# EAGLE schematic genesys (EAGLE 9.5.1)

## Sheet 1 of 16
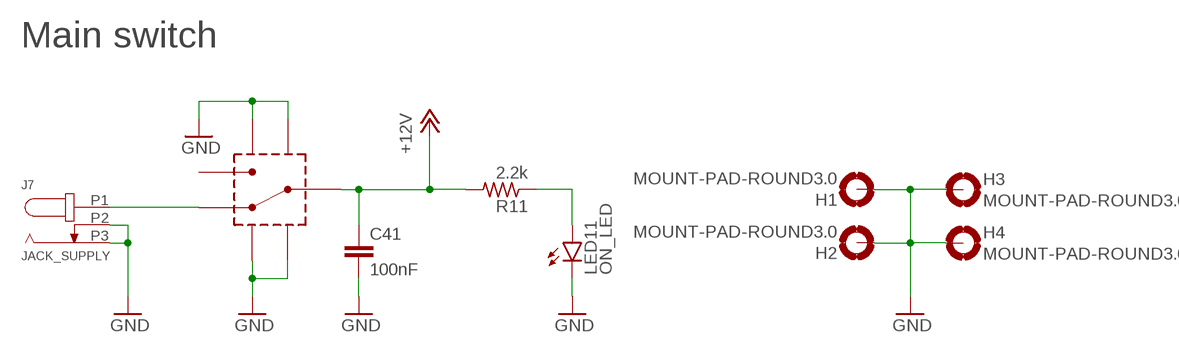
[diagram p0: schematic, sheet 1]

### Parts
C41  100nF  C-EUC0805K  [C0805K]
H1  MOUNT-PAD-ROUND3.0  [3,0-PAD]
H2  MOUNT-PAD-ROUND3.0  [3,0-PAD]
H3  MOUNT-PAD-ROUND3.0  [3,0-PAD]
H4  MOUNT-PAD-ROUND3.0  [3,0-PAD]
J7  JACK_SUPPLY  [DC-10LP]
LED11  ON_LED  LEDCHIPLED_0603  [CHIPLED_0603]
R11  2.2k  R-US_R0603  [R0603]
S1  SWITCH_1P  [SWITCH_1P]

### Nets
+12V: C41.1 R11.2 S1.P2 ; also sheet 2,4
GND: C41.2 H1.B3,0(MOUNT) H2.B3,0(MOUNT) H3.B3,0(MOUNT) H4.B3,0(MOUNT) J7.P2 J7.P3 LED11.C S1.SHIELD@1(SHIELD) S1.SHIELD@2(SHIELD) S1.SHIELD@3(SHIELD) S1.SHIELD@4(SHIELD) ; also sheet 2,3,4,5,6,7,8,9,10,11,12,13,14,15,16
N$125: J7.P1 S1.P1
N$126: LED11.A R11.1
Unconnected: S1.P3

### Notes on the sheet
- Main switch

## Sheet 2 of 16
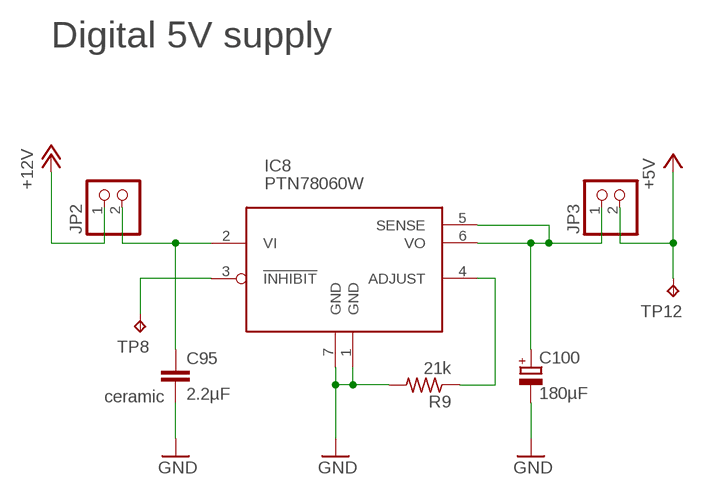
[diagram p1: schematic, sheet 2]

### Parts
C95  2.2µF  C-EUC1206  [C1206]
C100  180µF  CPOL-EUE3.5-8  [E3,5-8]
IC8  PTN78060W  [R-PDSS-T7]
JP2  PINHD-1X2  [1X02]
JP3  PINHD-1X2  [1X02]
R9  21k  R-US_R0805  [R0805]
TP8  TPTP15R  [TP15R]
TP12  TPTP15R  [TP15R]

### Nets
+5V: JP3.2 TP12.TP ; also sheet 3,5,7,8,13
+12V: JP2.1 ; also sheet 1,4
GND: C95.2 C100.- IC8.1(GND) IC8.7(GND) R9.2 ; also sheet 1,3,4,5,6,7,8,9,10,11,12,13,14,15,16
N$4: C95.1 IC8.2(VI) JP2.2
N$16: C100.+ IC8.5(SENSE) IC8.6(VO) JP3.1
N$91: IC8.3(!INHIBIT) TP8.TP
N$116: IC8.4(ADJUST) R9.1

### Notes on the sheet
- Digital 5V supply
- ceramic

## Sheet 3 of 16
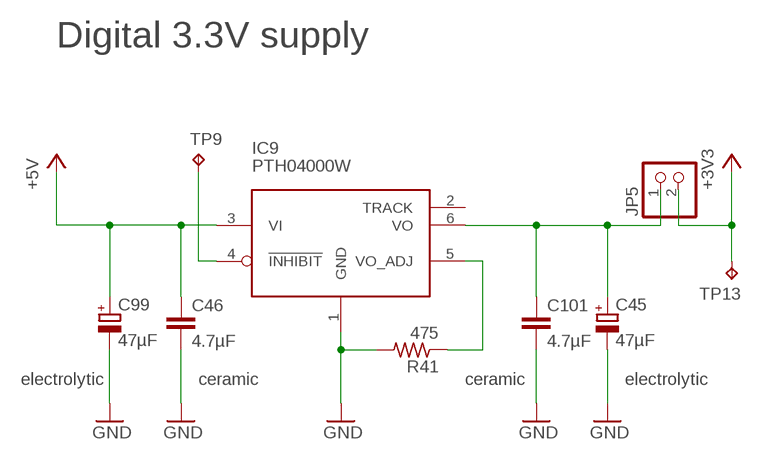
[diagram p2: schematic, sheet 3]

### Parts
C45  47µF  CPOL-EUE2.5-7  [E2,5-7]
C46  4.7µF  C-EUC0805K  [C0805K]
C99  47µF  CPOL-EUE2.5-7  [E2,5-7]
C101  4.7µF  C-EUC0805K  [C0805K]
IC9  PTH04000W  [R-PDSS-T6]
JP5  PINHD-1X2  [1X02]
R41  475  R-US_R0805  [R0805]
TP9  TPTP15R  [TP15R]
TP13  TPTP15R  [TP15R]

### Nets
+3V3: JP5.2 TP13.TP ; also sheet 5,6,7,8,9,10,11,12,13,14
+5V: C46.1 C99.+ IC9.3(VI) ; also sheet 2,5,7,8,13
GND: C45.- C46.2 C99.- C101.2 IC9.1(GND) R41.2 ; also sheet 1,2,4,5,6,7,8,9,10,11,12,13,14,15,16
N$51: IC9.5(VO_ADJ) R41.1
N$92: IC9.4(!INHIBIT) TP9.TP
N$120: C45.+ C101.1 IC9.6(VO) JP5.1

### Notes on the sheet
- Digital 3.3V supply
- electrolytic | ceramic | ceramic | electrolytic

## Sheet 4 of 16
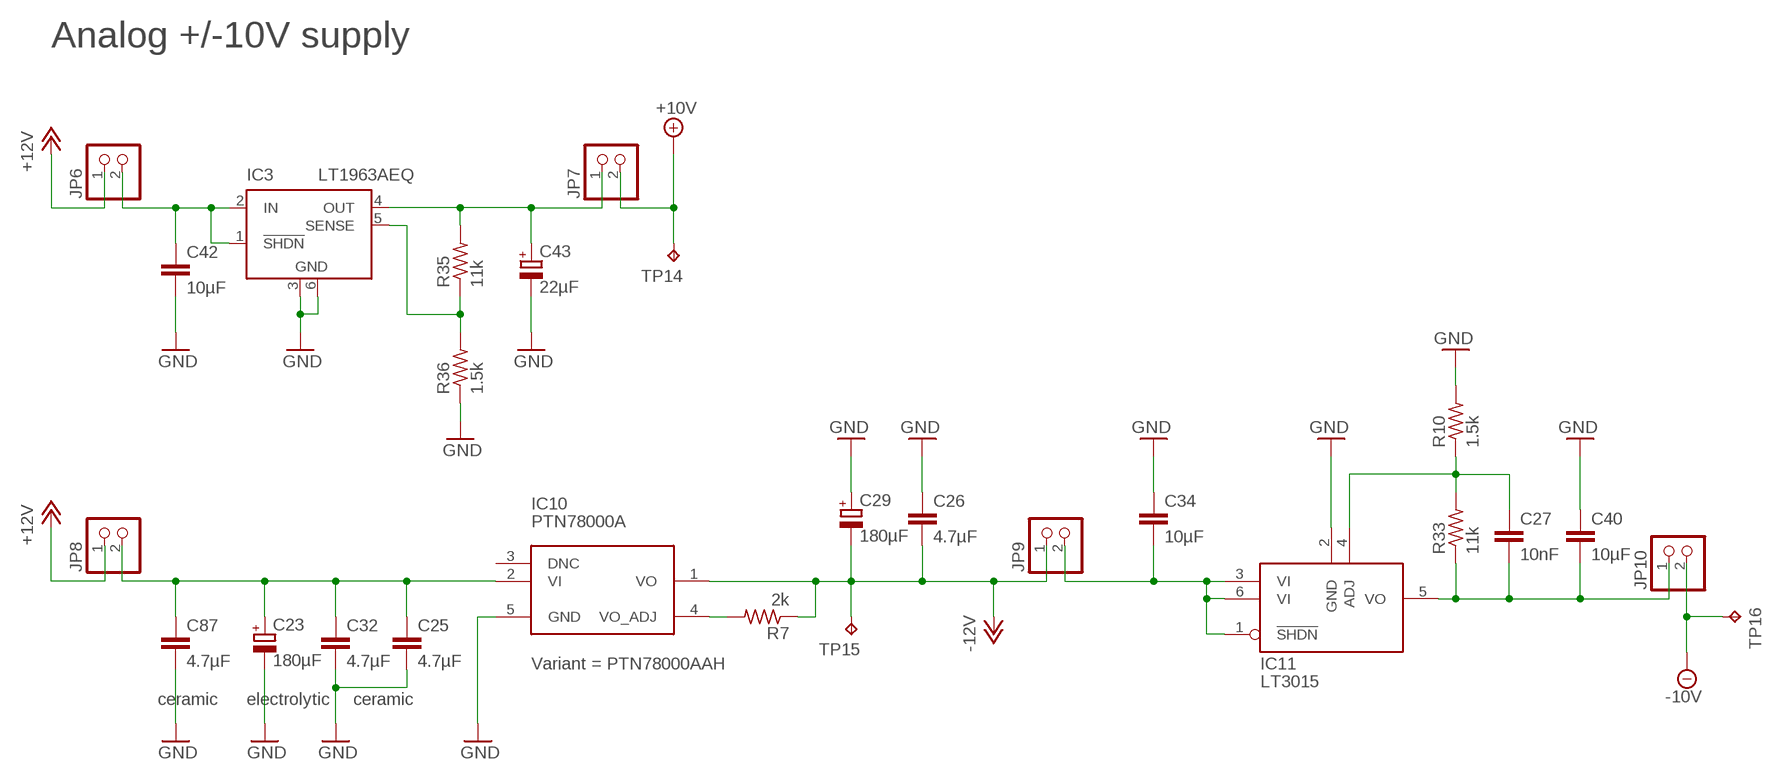
[diagram p3: schematic, sheet 4]

### Parts
C23  180µF  CPOL-EUE3.5-8  [E3,5-8]
C25  4.7µF  C-EUC0805K  [C0805K]
C26  4.7µF  C-EUC0805K  [C0805K]
C27  10nF  C-EUC0805K  [C0805K]
C29  180µF  CPOL-EUE3.5-8  [E3,5-8]
C32  4.7µF  C-EUC0805K  [C0805K]
C34  10µF  C-EUC0805K  [C0805K]
C40  10µF  C-EUC0805K  [C0805K]
C42  10µF  C-EUC0805K  [C0805K]
C43  22µF  CPOL-EUCT3528  [CT3528]
C87  4.7µF  C-EUC0805K  [C0805K]
IC3  LT1963AEQ  [Q5-DD]
IC10  PTN78000A  [R-PDSS-T5]
IC11  LT3015  [Q5-DD]
JP6  PINHD-1X2  [1X02]
JP7  PINHD-1X2  [1X02]
JP8  PINHD-1X2  [1X02]
JP9  PINHD-1X2  [1X02]
JP10  PINHD-1X2  [1X02]
R7  2k  R-US_R0805  [R0805]
R10  1.5k  R-US_R0805  [R0805]
R33  11k  R-US_R0805  [R0805]
R35  11k  R-US_R0805  [R0805]
R36  1.5k  R-US_R0805  [R0805]
TP14  TPTP15R  [TP15R]
TP15  TPTP15R  [TP15R]
TP16  TPTP15R  [TP15R]

### Nets
+10V: JP7.2 TP14.TP ; also sheet 15,16
+12V: JP6.1 JP8.1 ; also sheet 1,2
-10V: JP10.2 TP16.TP ; also sheet 15,16
-12V: C26.2 C29.- IC10.1(VO) JP9.1 R7.1 TP15.TP
GND: C23.- C25.2 C26.1 C29.+ C32.2 C34.1 C40.1 C42.2 C43.- C87.2 IC3.3(GND) IC3.6(GND) IC10.5(GND) IC11.2(GND) R10.2 R36.1 ; also sheet 1,2,3,5,6,7,8,9,10,11,12,13,14,15,16
N$36: IC3.5(SENSE) R35.1 R36.2
N$117: IC10.4(VO_ADJ) R7.2
N$118: C27.1 IC11.4(ADJ) R10.1 R33.2
N$119: C42.1 IC3.1(!SHDN) IC3.2(IN) JP6.2
N$121: C43.+ IC3.4(OUT) JP7.1 R35.2
N$122: C34.2 IC11.1(!SHDN) IC11.3(VI) IC11.6(VI) JP9.2
N$123: C23.+ C25.1 C32.1 C87.1 IC10.2(VI) JP8.2
N$124: C27.2 C40.2 IC11.5(VO) JP10.1 R33.1
Unconnected: IC10.3(DNC)

### Notes on the sheet
- Analog +/-10V supply
- Variant = PTN78000AAH
- ceramic | electrolytic | ceramic

## Sheet 5 of 16
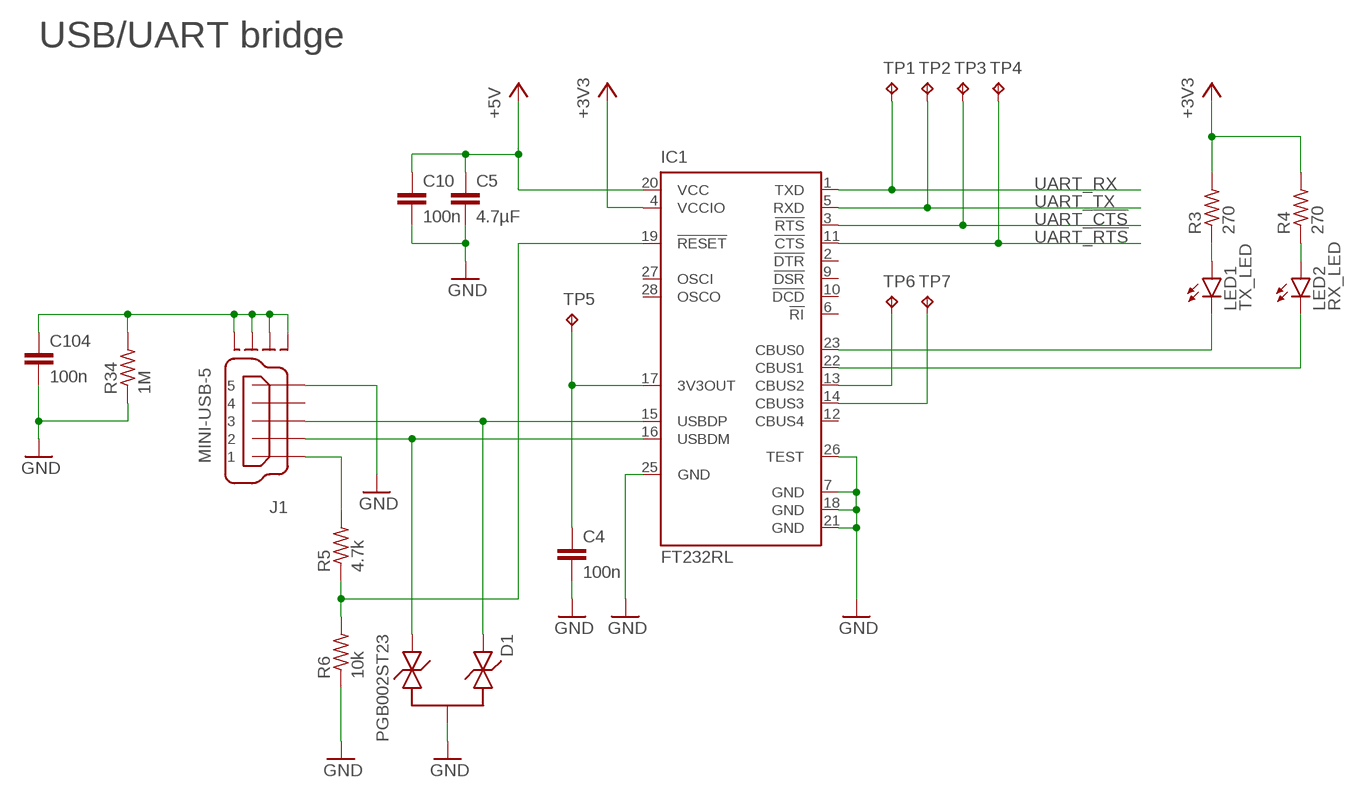
[diagram p4: schematic, sheet 5]

### Parts
C4  100n  C-EUC0805K  [C0805K]
C5  4.7µF  C-EUC0805K  [C0805K]
C10  100n  C-EUC0805K  [C0805K]
C104  100n  C-EUC0805K  [C0805K]
D1  PGB002ST23  [SOT23]
IC1  FT232RL  [SSOP28]
J1  MINI-USB-5  [56579-0579]
LED1  TX_LED  LEDCHIPLED_0603  [CHIPLED_0603]
LED2  RX_LED  LEDCHIPLED_0603  [CHIPLED_0603]
R3  270  R-US_R0603  [R0603]
R4  270  R-US_R0603  [R0603]
R5  4.7k  R-US_R0603  [R0603]
R6  10k  R-US_R0603  [R0603]
R34  1M  R-US_R0603  [R0603]
TP1  TPTP15R  [TP15R]
TP2  TPTP15R  [TP15R]
TP3  TPTP15R  [TP15R]
TP4  TPTP15R  [TP15R]
TP5  TPTP15R  [TP15R]
TP6  TPTP15R  [TP15R]
TP7  TPTP15R  [TP15R]

### Nets
+3V3: IC1.4(VCCIO) R3.2 R4.2 ; also sheet 3,6,7,8,9,10,11,12,13,14
+5V: C5.1 C10.1 IC1.20(VCC) ; also sheet 2,3,7,8,13
GND: C4.2 C5.2 C10.2 C104.2 D1.3 IC1.7(GND) IC1.18(GND) IC1.21(GND) IC1.25(GND) IC1.26(TEST) J1.GND R6.1 R34.1 ; also sheet 1,2,3,4,6,7,8,9,10,11,12,13,14,15,16
N$1: C4.1 IC1.17(3V3OUT) TP5.TP
N$5: IC1.23(CBUS0) LED1.C
N$6: IC1.22(CBUS1) LED2.C
N$7: LED1.A R3.1
N$8: LED2.A R4.1
N$9: D1.2 IC1.16(USBDM) J1.DN
N$10: J1.VBUS R5.2
N$11: IC1.19(!RESET) R5.1 R6.2
N$12: D1.1 IC1.15(USBDP) J1.DP
N$58: IC1.13(CBUS2) TP6.TP
N$88: IC1.14(CBUS3) TP7.TP
N$93: C104.1 J1.SHIELD@1(S1) J1.SHIELD@2(S2) J1.SHIELD@3(S3) J1.SHIELD@4(S4) R34.2
UART_!CTS: IC1.3(!RTS) TP3.TP ; also sheet 7
UART_!RTS: IC1.11(!CTS) TP4.TP ; also sheet 7
UART_RX: IC1.1(TXD) TP1.TP ; also sheet 7
UART_TX: IC1.5(RXD) TP2.TP ; also sheet 7
Unconnected: IC1.2(!DTR) IC1.6(!RI) IC1.9(!DSR) IC1.10(!DCD) IC1.12(CBUS4) IC1.27(OSCI) IC1.28(OSCO) J1.NC

### Notes on the sheet
- USB/UART bridge

## Sheet 6 of 16
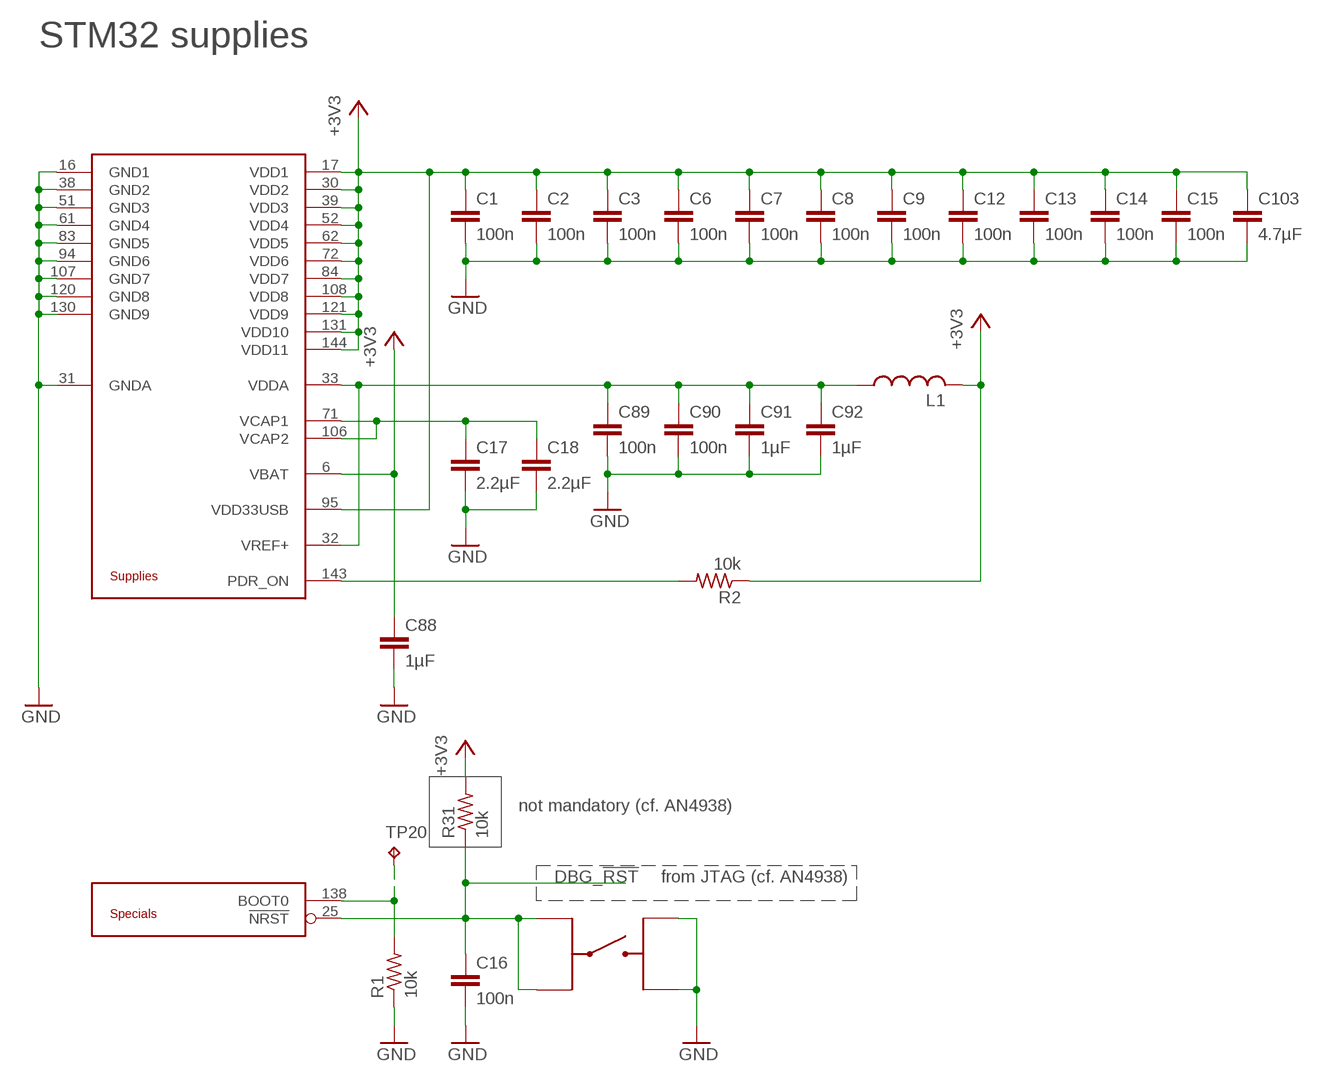
[diagram p5: schematic, sheet 6]

### Parts
B1  KSC521G  [KSC521G]
C1  100n  C-EUC0805K  [C0805K]
C2  100n  C-EUC0805K  [C0805K]
C3  100n  C-EUC0805K  [C0805K]
C6  100n  C-EUC0805K  [C0805K]
C7  100n  C-EUC0805K  [C0805K]
C8  100n  C-EUC0805K  [C0805K]
C9  100n  C-EUC0805K  [C0805K]
C12  100n  C-EUC0805K  [C0805K]
C13  100n  C-EUC0805K  [C0805K]
C14  100n  C-EUC0805K  [C0805K]
C15  100n  C-EUC0805K  [C0805K]
C16  100n  C-EUC0805K  [C0805K]
C17  2.2µF  C-EUC0805K  [C0805K]
C18  2.2µF  C-EUC0805K  [C0805K]
C88  1µF  C-EUC0805K  [C0805K]
C89  100n  C-EUC0805K  [C0805K]
C90  100n  C-EUC0805K  [C0805K]
C91  1µF  C-EUC0805K  [C0805K]
C92  1µF  C-EUC0805K  [C0805K]
C103  4.7µF  C-EUC0805K  [C0805K]
L1  L-USL3216C  [L3216C]
R1  10k  R-US_R0805  [R0805]
R2  10k  R-US_R0805  [R0805]
R31  10k  R-US_R0805  [R0805]
TP20  TPTP15R  [TP15R]
U$1  STM32H743ZI  [TQFP144]

### Nets
+3V3: C1.1 C2.1 C3.1 C6.1 C7.1 C8.1 C9.1 C12.1 C13.1 C14.1 C15.1 C88.1 C103.1 L1.2 R2.1 R31.2 U$1.6(VBAT) U$1.17(VDD1) U$1.30(VDD2) U$1.39(VDD3) U$1.52(VDD4) U$1.62(VDD5) U$1.72(VDD6) U$1.84(VDD7) U$1.95(VDD33USB) U$1.108(VDD8) U$1.121(VDD9) U$1.131(VDD10) U$1.144(VDD11) ; also sheet 3,5,7,8,9,10,11,12,13,14
DBG_!RST: B1.3 B1.4 C16.1 R31.1 U$1.25(!NRST) ; also sheet 12
GND: B1.1 B1.2 C1.2 C2.2 C3.2 C6.2 C7.2 C8.2 C9.2 C12.2 C13.2 C14.2 C15.2 C16.2 C17.2 C18.2 C88.2 C89.2 C90.2 C91.2 C92.2 C103.2 R1.1 U$1.16(GND1) U$1.31(GNDA) U$1.38(GND2) U$1.51(GND3) U$1.61(GND4) U$1.83(GND5) U$1.94(GND6) U$1.107(GND7) U$1.120(GND8) U$1.130(GND9) ; also sheet 1,2,3,4,5,7,8,9,10,11,12,13,14,15,16
N$2: R1.2 TP20.TP U$1.138(BOOT0)
N$3: C89.1 C90.1 C91.1 C92.1 L1.1 U$1.32(VREF+) U$1.33(VDDA)
N$13: R2.2 U$1.143(PDR_ON)
N$14: C17.1 C18.1 U$1.71(VCAP1) U$1.106(VCAP2)

### Notes on the sheet
- STM32 supplies
- not mandatory (cf. AN4938)
- from JTAG (cf. AN4938)

## Sheet 7 of 16
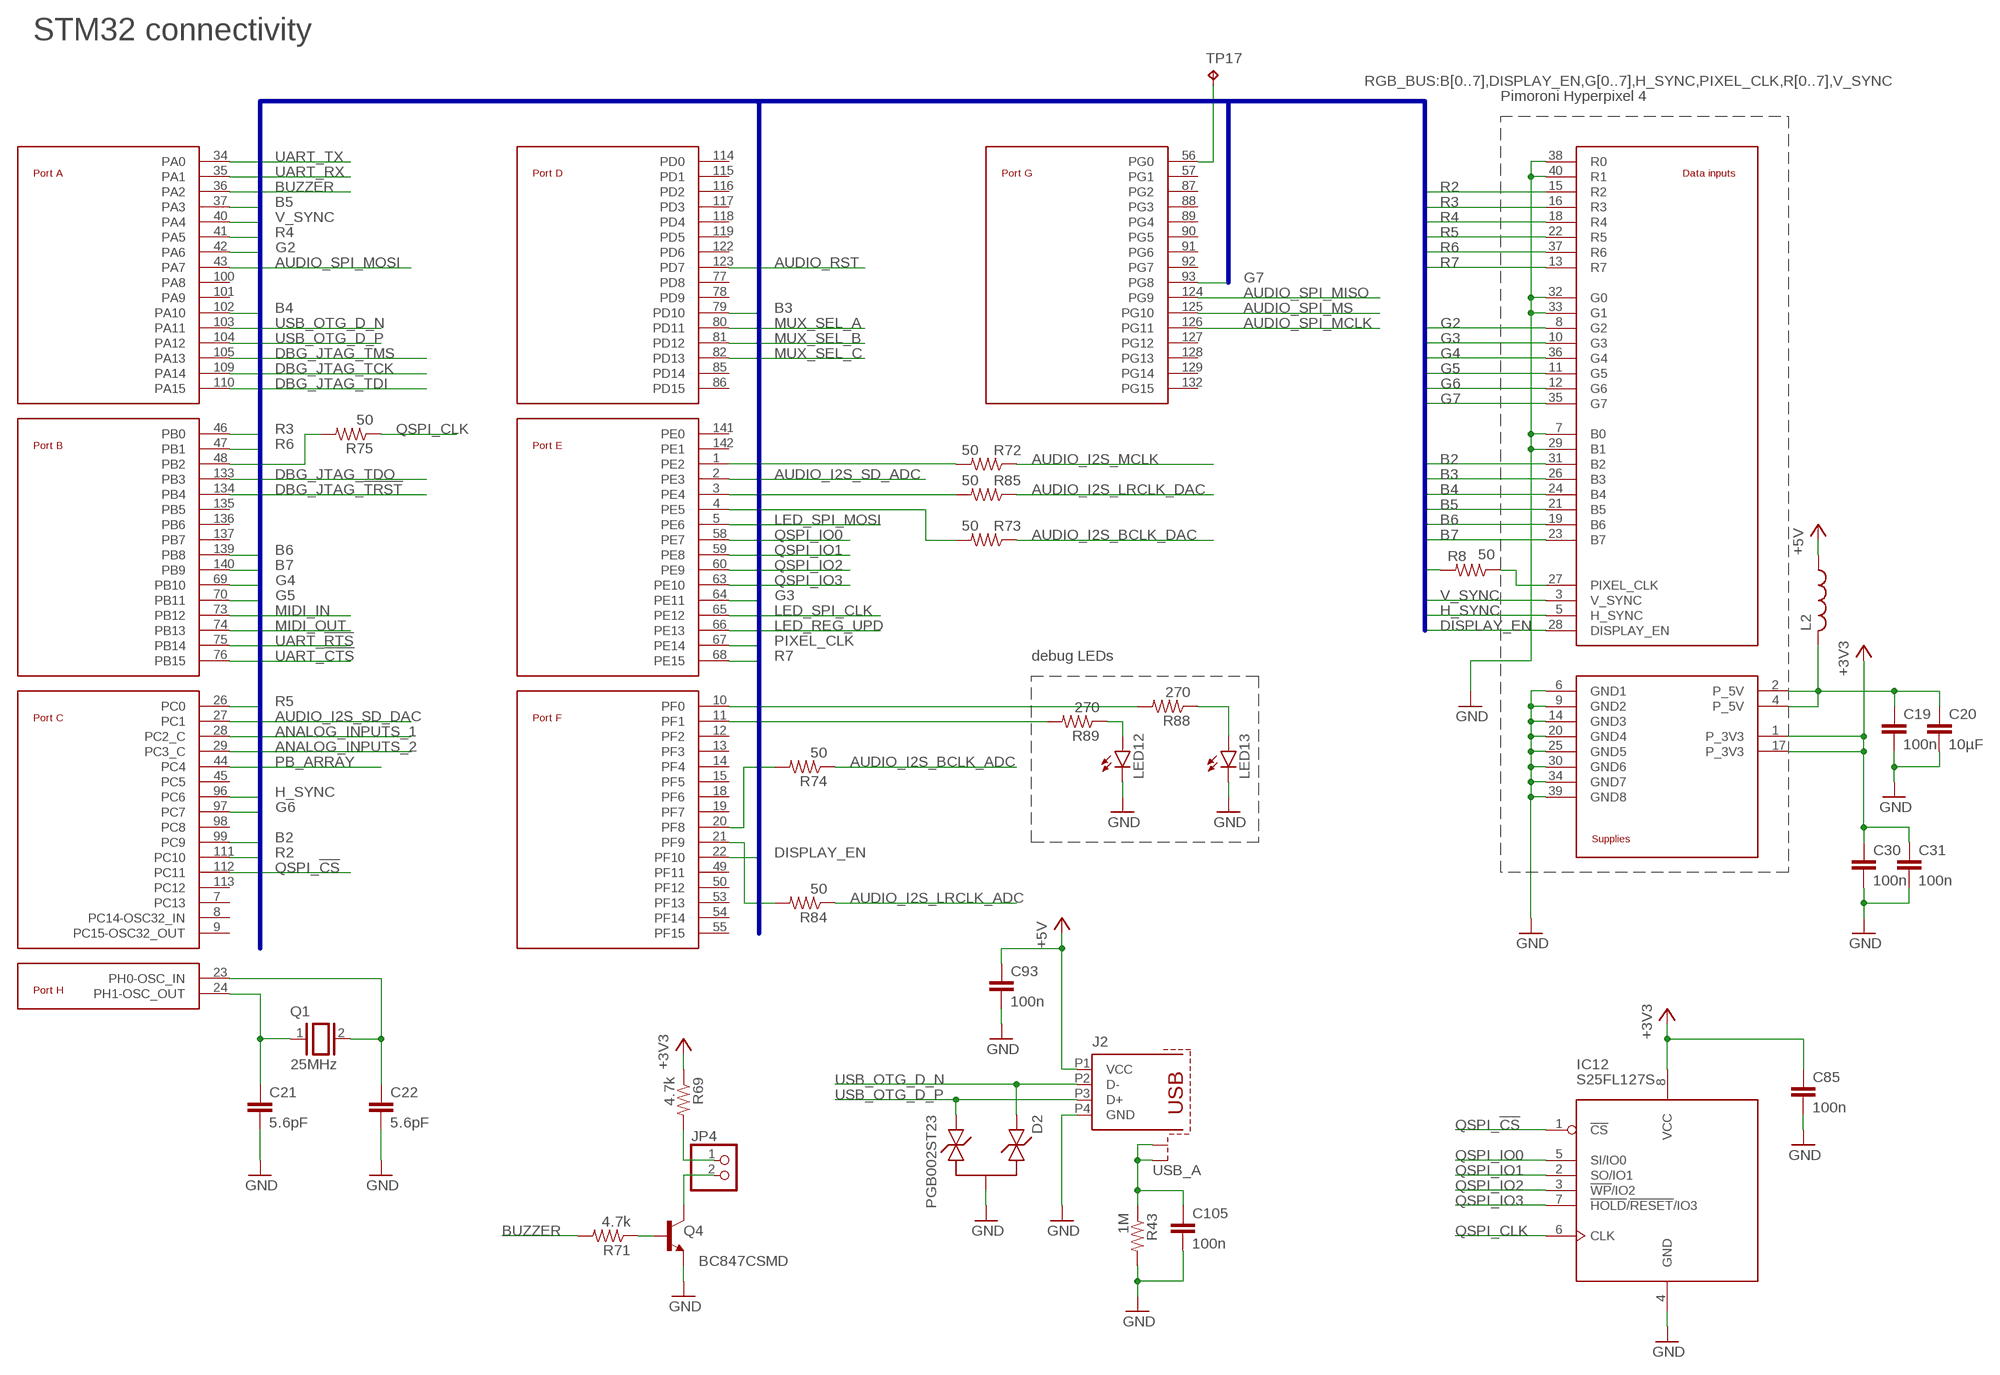
[diagram p6: schematic, sheet 7]

### Parts
C19  100n  C-EUC0805K  [C0805K]
C20  10µF  C-EUC0805K  [C0805K]
C21  5.6pF  C-EUC0805K  [C0805K]
C22  5.6pF  C-EUC0805K  [C0805K]
C30  100n  C-EUC0805K  [C0805K]
C31  100n  C-EUC0805K  [C0805K]
C85  100n  C-EUC0805K  [C0805K]
C93  100n  C-EUC0805K  [C0805K]
C105  100n  C-EUC0805K  [C0805K]
D2  PGB002ST23  [SOT23]
IC12  S25FL127S  [SO8]
J2  USB_A  [USB_A]
JP4  PINHD-1X2  [1X02]
L2  L-USL3216C  [L3216C]
LED12  USR_LED_1  LEDCHIPLED_0603  [CHIPLED_0603]
LED13  USR_LED_1  LEDCHIPLED_0603  [CHIPLED_0603]
Q1  25MHz  XTAL/S  [QS]
Q4  BC847CSMD  [SOT23]
R8  50  R-US_R0805  [R0805]
R43  1M  R-US_R0603  [R0603]
R69  4.7k  R-US_R0805  [R0805]
R71  4.7k  R-US_R0805  [R0805]
R72  50  R-US_R0603  [R0603]
R73  50  R-US_R0603  [R0603]
R74  50  R-US_R0603  [R0603]
R75  50  R-US_R0603  [R0603]
R84  50  R-US_R0603  [R0603]
R85  50  R-US_R0603  [R0603]
R88  270  R-US_R0603  [R0603]
R89  270  R-US_R0603  [R0603]
TP17  TPTP15R  [TP15R]
U$2  HYPERPIXEL4.0  [HYPERPIXEL4.0]

### Nets
+3V3: C30.1 C31.1 C85.1 IC12.8(VCC) R69.1 U$2.1(SUPP:P_3V3) U$2.17(SUPP:P_3V3) ; also sheet 3,5,6,8,9,10,11,12,13,14
+5V: C93.1 J2.P1(VCC) L2.1 ; also sheet 2,3,5,8,13
ANALOG_INPUTS_1: U$1.28(PC2_C) ; also sheet 9
ANALOG_INPUTS_2: U$1.29(PC3_C) ; also sheet 9
AUDIO_I2S_BCLK_ADC: R74.1 ; also sheet 14
AUDIO_I2S_BCLK_DAC: R73.1 ; also sheet 14
AUDIO_I2S_LRCLK_ADC: R84.1 ; also sheet 14
AUDIO_I2S_LRCLK_DAC: R85.1 ; also sheet 14
AUDIO_I2S_MCLK: R72.1 ; also sheet 14
AUDIO_I2S_SD_ADC: U$1.2(PE3) ; also sheet 14
AUDIO_I2S_SD_DAC: U$1.27(PC1) ; also sheet 14
AUDIO_RST: U$1.123(PD7) ; also sheet 14
AUDIO_SPI_MCLK: U$1.126(PG11) ; also sheet 14
AUDIO_SPI_MISO: U$1.124(PG9) ; also sheet 14
AUDIO_SPI_MOSI: U$1.43(PA7) ; also sheet 14
AUDIO_SPI_MS: U$1.125(PG10) ; also sheet 14
B2: U$1.99(PC9) U$2.31(DISP:B2)
B3: U$1.79(PD10) U$2.26(DISP:B3)
B4: U$1.102(PA10) U$2.24(DISP:B4)
B5: U$1.37(PA3) U$2.21(DISP:B5)
B6: U$1.139(PB8) U$2.19(DISP:B6)
B7: U$1.140(PB9) U$2.23(DISP:B7)
BUZZER: R71.2 U$1.36(PA2)
DBG_JTAG_!TRST: U$1.134(PB4) ; also sheet 12
DBG_JTAG_TCK: U$1.109(PA14) ; also sheet 12
DBG_JTAG_TDI: U$1.110(PA15) ; also sheet 12
DBG_JTAG_TDO: U$1.133(PB3) ; also sheet 12
DBG_JTAG_TMS: U$1.105(PA13) ; also sheet 12
DISPLAY_EN: U$1.22(PF10) U$2.28(DISP:DISPLAY_EN)
G2: U$1.42(PA6) U$2.8(DISP:G2)
G3: U$1.64(PE11) U$2.10(DISP:G3)
G4: U$1.69(PB10) U$2.36(DISP:G4)
G5: U$1.70(PB11) U$2.11(DISP:G5)
G6: U$1.97(PC7) U$2.12(DISP:G6)
G7: U$1.93(PG8) U$2.35(DISP:G7)
GND: C19.2 C20.2 C21.2 C22.2 C30.2 C31.2 C85.2 C93.2 C105.2 D2.3 IC12.4(GND) J2.P4(GND) LED12.C LED13.C Q4.2(E) R43.2 U$2.6(SUPP:GND1) U$2.7(DISP:B0) U$2.9(SUPP:GND2) U$2.14(SUPP:GND3) U$2.20(SUPP:GND4) U$2.25(SUPP:GND5) U$2.29(DISP:B1) U$2.30(SUPP:GND6) U$2.32(DISP:G0) U$2.33(DISP:G1) U$2.34(SUPP:GND7) U$2.38(DISP:R0) U$2.39(SUPP:GND8) U$2.40(DISP:R1) ; also sheet 1,2,3,4,5,6,8,9,10,11,12,13,14,15,16
H_SYNC: U$1.96(PC6) U$2.5(DISP:H_SYNC)
LED_REG_UPD: U$1.66(PE13) ; also sheet 10
LED_SPI_CLK: U$1.65(PE12) ; also sheet 10
LED_SPI_MOSI: U$1.5(PE6) ; also sheet 10
MIDI_IN: U$1.73(PB12) ; also sheet 8
MIDI_OUT: U$1.74(PB13) ; also sheet 8
MUX_SEL_A: U$1.80(PD11) ; also sheet 9,11
MUX_SEL_B: U$1.81(PD12) ; also sheet 9,11
MUX_SEL_C: U$1.82(PD13) ; also sheet 9,11
N$15: R8.1 U$2.27(DISP:PIXEL_CLK)
N$17: C21.1 Q1.1 U$1.24(PH1-OSC_OUT)
N$18: C22.1 Q1.2 U$1.23(PH0-OSC_IN)
N$26: C19.1 C20.1 L2.2 U$2.2(SUPP:P_5V) U$2.4(SUPP:P_5V)
N$112: R88.2 U$1.10(PF0)
N$113: R89.2 U$1.11(PF1)
N$114: LED12.A R89.1
N$115: LED13.A R88.1
N$130: C105.1 J2.SHIELD@1(S1) J2.SHIELD@2(S2) R43.1
N$131: JP4.1 R69.2
N$132: JP4.2 Q4.3(C)
N$133: R72.2 U$1.1(PE2)
N$134: Q4.1(B) R71.1
N$135: R73.2 U$1.4(PE5)
N$136: R74.2 U$1.20(PF8)
N$137: R75.2 U$1.48(PB2)
N$138: TP17.TP U$1.56(PG0)
N$139: R84.2 U$1.21(PF9)
N$140: R85.2 U$1.3(PE4)
PB_ARRAY: U$1.44(PC4) ; also sheet 11
PIXEL_CLK: R8.2 U$1.67(PE14)
QSPI_!CS: IC12.1(!CS) U$1.112(PC11)
QSPI_CLK: IC12.6(CLK) R75.1
QSPI_IO0: IC12.5(SI/IO0) U$1.58(PE7)
QSPI_IO1: IC12.2(SO/IO1) U$1.59(PE8)
QSPI_IO2: IC12.3(!WP!/IO2) U$1.60(PE9)
QSPI_IO3: IC12.7(!HOLD!/!RESET!/IO3) U$1.63(PE10)
R2: U$1.111(PC10) U$2.15(DISP:R2)
R3: U$1.46(PB0) U$2.16(DISP:R3)
R4: U$1.41(PA5) U$2.18(DISP:R4)
R5: U$1.26(PC0) U$2.22(DISP:R5)
R6: U$1.47(PB1) U$2.37(DISP:R6)
R7: U$1.68(PE15) U$2.13(DISP:R7)
UART_!CTS: U$1.76(PB15) ; also sheet 5
UART_!RTS: U$1.75(PB14) ; also sheet 5
UART_RX: U$1.35(PA1) ; also sheet 5
UART_TX: U$1.34(PA0) ; also sheet 5
USB_OTG_D_N [USB diff pair]: D2.1 J2.P2(D-) U$1.103(PA11)
USB_OTG_D_P [USB diff pair]: D2.2 J2.P3(D+) U$1.104(PA12)
V_SYNC: U$1.40(PA4) U$2.3(DISP:V_SYNC)
Unconnected: U$1.7(PC13) U$1.8(PC14-OSC32_IN) U$1.9(PC15-OSC32_OUT) U$1.12(PF2) U$1.13(PF3) U$1.14(PF4) U$1.15(PF5) U$1.18(PF6) U$1.19(PF7) U$1.45(PC5) U$1.49(PF11) U$1.50(PF12) U$1.53(PF13) U$1.54(PF14) U$1.55(PF15) U$1.57(PG1) U$1.77(PD8) U$1.78(PD9) U$1.85(PD14) U$1.86(PD15) U$1.87(PG2) U$1.88(PG3) U$1.89(PG4) U$1.90(PG5) U$1.91(PG6) U$1.92(PG7) U$1.98(PC8) U$1.100(PA8) U$1.101(PA9) U$1.113(PC12) U$1.114(PD0) U$1.115(PD1) U$1.116(PD2) U$1.117(PD3) U$1.118(PD4) U$1.119(PD5) U$1.122(PD6) U$1.127(PG12) U$1.128(PG13) U$1.129(PG14) U$1.132(PG15) U$1.135(PB5) U$1.136(PB6) U$1.137(PB7) U$1.141(PE0) U$1.142(PE1)

### Buses
RGB_BUS:B[0..7],DISPLAY_EN,G[0..7],H_SYNC,PIXEL_CLK,R[0..7],V_SYNC

### Notes on the sheet
- STM32 connectivity
- Pimoroni Hyperpixel 4
- debug LEDs

## Sheet 8 of 16
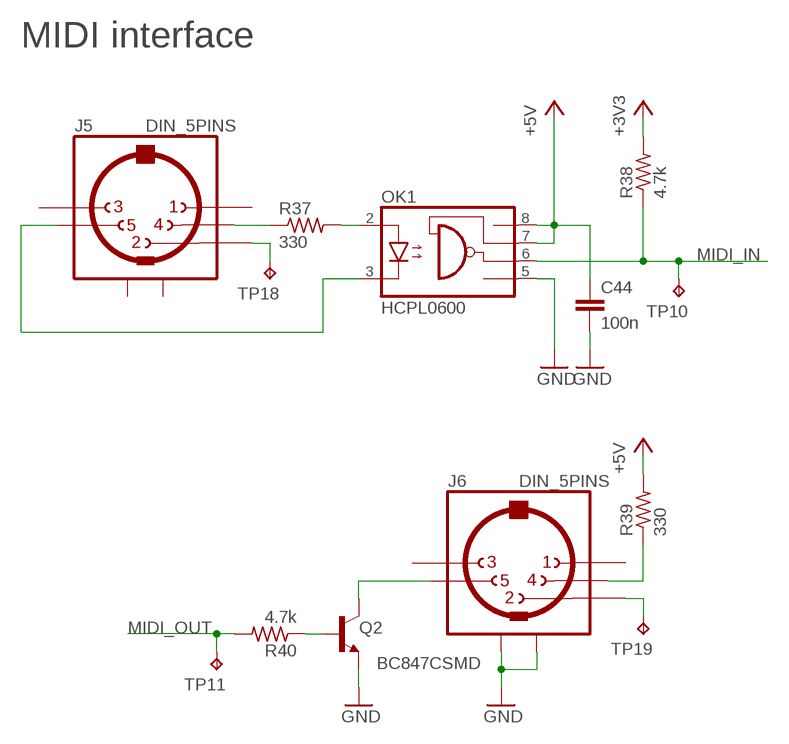
[diagram p7: schematic, sheet 8]

### Parts
C44  100n  C-EUC0805K  [C0805K]
J5  DIN_5PINS  [71251-050/0800]
J6  DIN_5PINS  [71251-050/0800]
OK1  HCPL0600  [SOIC08]
Q2  BC847CSMD  [SOT23]
R37  330  R-US_R0805  [R0805]
R38  4.7k  R-US_R0805  [R0805]
R39  330  R-US_R0805  [R0805]
R40  4.7k  R-US_R0805  [R0805]
TP10  TPTP15R  [TP15R]
TP11  TPTP15R  [TP15R]
TP18  TPTP15R  [TP15R]
TP19  TPTP15R  [TP15R]

### Nets
+3V3: R38.2 ; also sheet 3,5,6,7,9,10,11,12,13,14
+5V: C44.1 OK1.7(VE) OK1.8(VCC) R39.2 ; also sheet 2,3,5,7,13
GND: C44.2 J6.GND@1(SHIELD) J6.GND@2(SHIELD) OK1.5(GND) Q2.2(E) ; also sheet 1,2,3,4,5,6,7,9,10,11,12,13,14,15,16
MIDI_IN: OK1.6(VO) R38.1 TP10.TP ; also sheet 7
MIDI_OUT: R40.2 TP11.TP ; also sheet 7
N$39: J6.P4 R39.1
N$44: OK1.2(A) R37.2
N$45: J5.P5 OK1.3(C)
N$47: J5.P4 R37.1
N$48: J6.P5 Q2.3(C)
N$49: Q2.1(B) R40.1
N$141: J5.P2 TP18.TP
N$142: J6.P2 TP19.TP
Unconnected: J5.P1 J5.P3 J6.P1 J6.P3

### Notes on the sheet
- MIDI interface

## Sheet 9 of 16
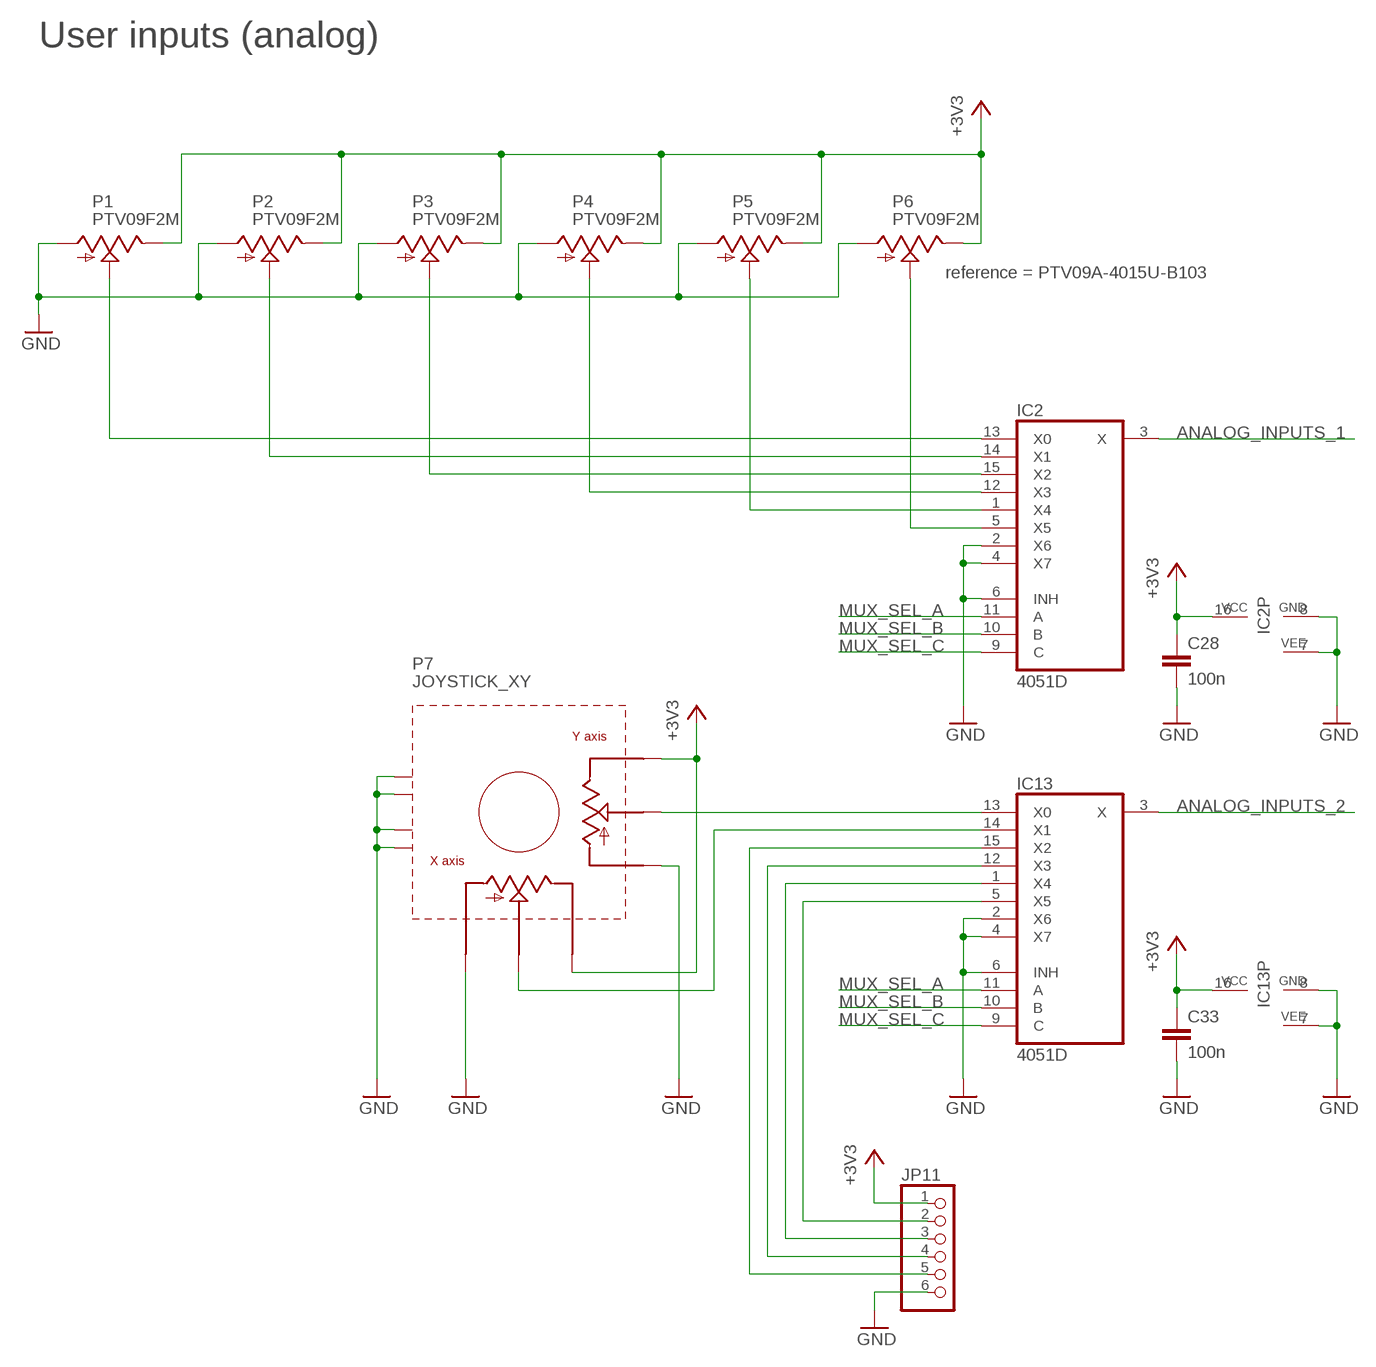
[diagram p8: schematic, sheet 9]

### Parts
C28  100n  C-EUC0805K  [C0805K]
C33  100n  C-EUC0805K  [C0805K]
IC2  4051D  [SO16]
IC13  4051D  [SO16]
JP11  PINHD-1X6  [1X06]
P1  PTV09F2M  [EVUFXM]
P2  PTV09F2M  [EVUFXM]
P3  PTV09F2M  [EVUFXM]
P4  PTV09F2M  [EVUFXM]
P5  PTV09F2M  [EVUFXM]
P6  PTV09F2M  [EVUFXM]
P7  JOYSTICK_XY  [RKJXK1210002]

### Nets
+3V3: C28.1 C33.1 IC2.16(VCC) IC13.16(VCC) JP11.1 P1.3(E) P2.3(E) P3.3(E) P4.3(E) P5.3(E) P6.3(E) P7.PX3 P7.PY3 ; also sheet 3,5,6,7,8,10,11,12,13,14
ANALOG_INPUTS_1: IC2.3(X) ; also sheet 7
ANALOG_INPUTS_2: IC13.3(X) ; also sheet 7
GND: C28.2 C33.2 IC2.2(X6) IC2.4(X7) IC2.6(INH) IC2.7(VEE) IC2.8(GND) IC13.2(X6) IC13.4(X7) IC13.6(INH) IC13.7(VEE) IC13.8(GND) JP11.6 P1.1(A) P2.1(A) P3.1(A) P4.1(A) P5.1(A) P6.1(A) P7.PX1 P7.PY1 P7.SHIELD@1(SHIELD) P7.SHIELD@2(SHIELD) P7.SHIELD@3(SHIELD) P7.SHIELD@4(SHIELD) ; also sheet 1,2,3,4,5,6,7,8,10,11,12,13,14,15,16
MUX_SEL_A: IC2.11(A) IC13.11(A) ; also sheet 7,11
MUX_SEL_B: IC2.10(B) IC13.10(B) ; also sheet 7,11
MUX_SEL_C: IC2.9(C) IC13.9(C) ; also sheet 7,11
N$19: IC2.12(X3) P4.2(S)
N$20: IC2.15(X2) P3.2(S)
N$21: IC2.14(X1) P2.2(S)
N$22: IC2.13(X0) P1.2(S)
N$24: IC2.1(X4) P5.2(S)
N$63: IC13.14(X1) P7.PX2
N$89: IC2.5(X5) P6.2(S)
N$110: IC13.15(X2) JP11.5
N$111: IC13.12(X3) JP11.4
N$127: IC13.13(X0) P7.PY2
N$128: IC13.1(X4) JP11.3
N$129: IC13.5(X5) JP11.2

### Notes on the sheet
- User inputs (analog)
- reference = PTV09A-4015U-B103

## Sheet 10 of 16
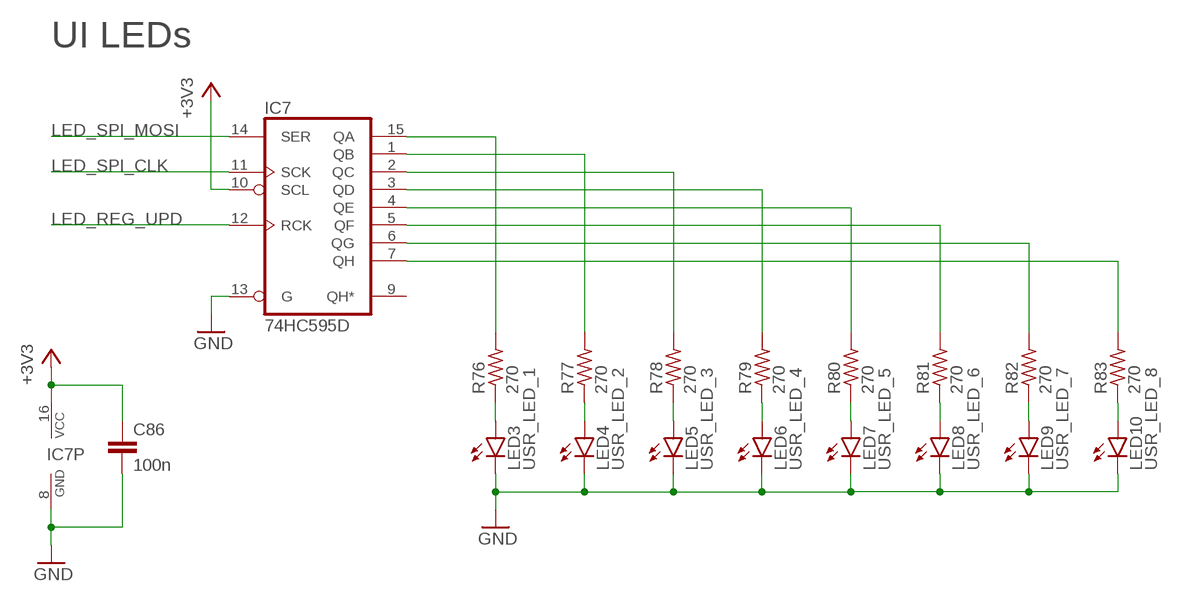
[diagram p9: schematic, sheet 10]

### Parts
C86  100n  C-EUC0805K  [C0805K]
IC7  74HC595D  [SO16]
LED3  USR_LED_1  LEDCHIPLED_0603  [CHIPLED_0603]
LED4  USR_LED_2  LEDCHIPLED_0603  [CHIPLED_0603]
LED5  USR_LED_3  LEDCHIPLED_0603  [CHIPLED_0603]
LED6  USR_LED_4  LEDCHIPLED_0603  [CHIPLED_0603]
LED7  USR_LED_5  LEDCHIPLED_0603  [CHIPLED_0603]
LED8  USR_LED_6  LEDCHIPLED_0603  [CHIPLED_0603]
LED9  USR_LED_7  LEDCHIPLED_0603  [CHIPLED_0603]
LED10  USR_LED_8  LEDCHIPLED_0603  [CHIPLED_0603]
R76  270  R-US_R0603  [R0603]
R77  270  R-US_R0603  [R0603]
R78  270  R-US_R0603  [R0603]
R79  270  R-US_R0603  [R0603]
R80  270  R-US_R0603  [R0603]
R81  270  R-US_R0603  [R0603]
R82  270  R-US_R0603  [R0603]
R83  270  R-US_R0603  [R0603]

### Nets
+3V3: C86.1 IC7.10(SCL) IC7.16(VCC) ; also sheet 3,5,6,7,8,9,11,12,13,14
GND: C86.2 IC7.8(GND) IC7.13(G) LED3.C LED4.C LED5.C LED6.C LED7.C LED8.C LED9.C LED10.C ; also sheet 1,2,3,4,5,6,7,8,9,11,12,13,14,15,16
LED_REG_UPD: IC7.12(RCK) ; also sheet 7
LED_SPI_CLK: IC7.11(SCK) ; also sheet 7
LED_SPI_MOSI: IC7.14(SER) ; also sheet 7
N$94: LED3.A R76.1
N$95: LED4.A R77.1
N$96: IC7.1(QB) R77.2
N$97: IC7.15(QA) R76.2
N$98: LED5.A R78.1
N$99: LED6.A R79.1
N$100: IC7.3(QD) R79.2
N$101: IC7.2(QC) R78.2
N$102: LED7.A R80.1
N$103: LED8.A R81.1
N$104: IC7.5(QF) R81.2
N$105: IC7.4(QE) R80.2
N$106: LED9.A R82.1
N$107: LED10.A R83.1
N$108: IC7.7(QH) R83.2
N$109: IC7.6(QG) R82.2
Unconnected: IC7.9(QH*)

### Notes on the sheet
- UI LEDs

## Sheet 11 of 16
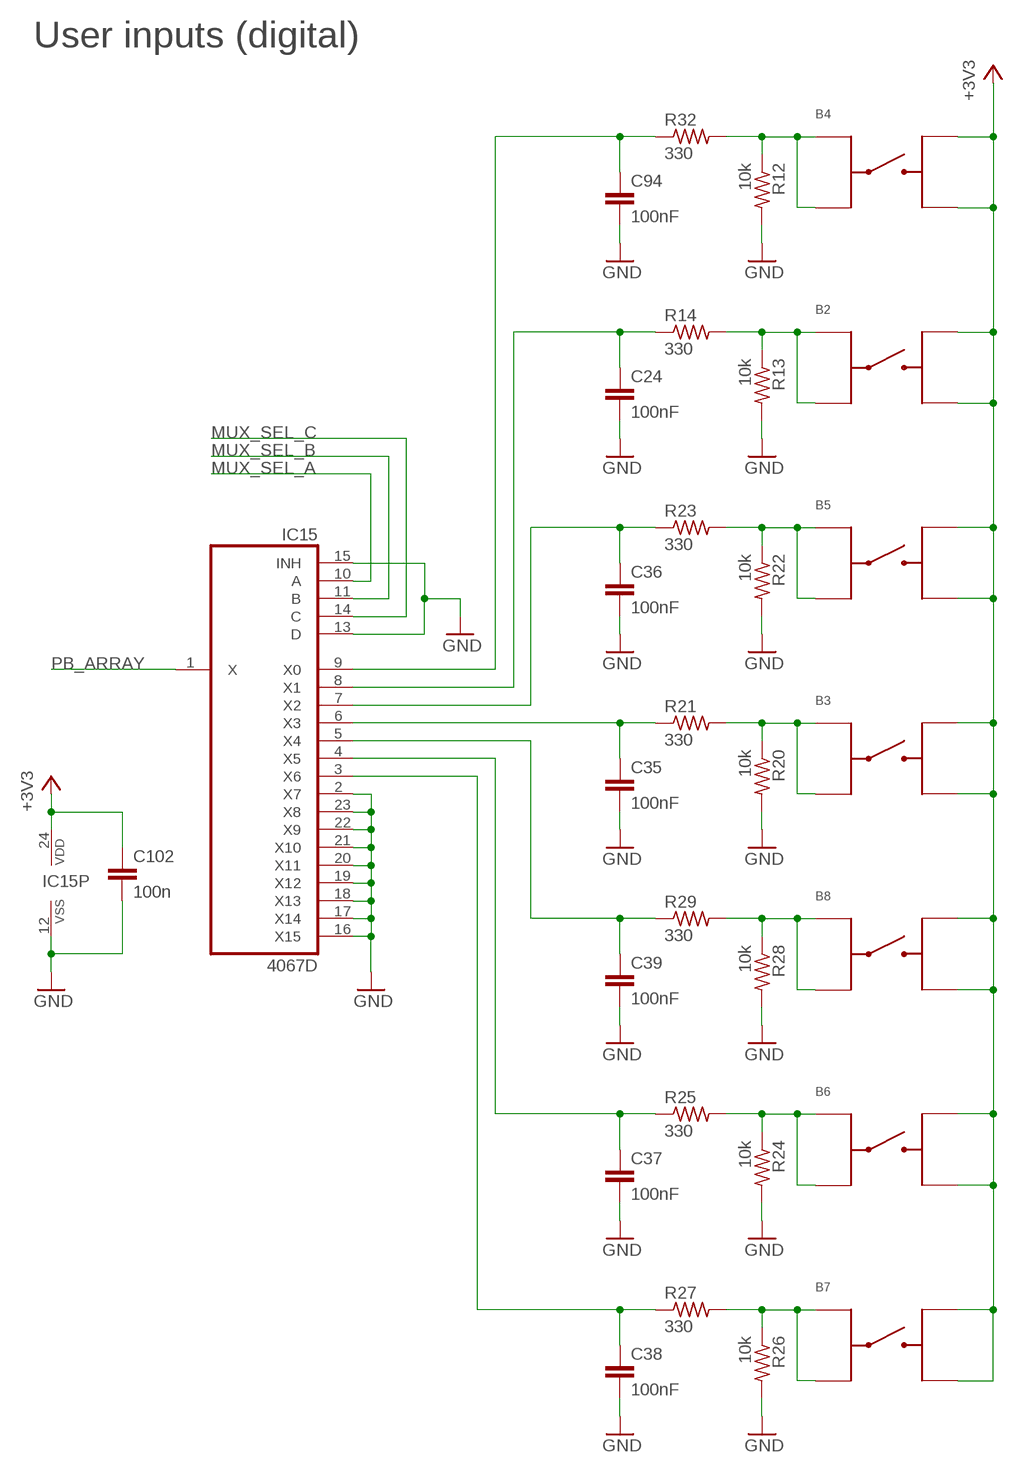
[diagram p10: schematic, sheet 11]

### Parts
B2  KSC521G  [KSC521G]
B3  KSC521G  [KSC521G]
B4  KSC521G  [KSC521G]
B5  KSC521G  [KSC521G]
B6  KSC521G  [KSC521G]
B7  KSC521G  [KSC521G]
B8  KSC521G  [KSC521G]
C24  100nF  C-EUC0805K  [C0805K]
C35  100nF  C-EUC0805K  [C0805K]
C36  100nF  C-EUC0805K  [C0805K]
C37  100nF  C-EUC0805K  [C0805K]
C38  100nF  C-EUC0805K  [C0805K]
C39  100nF  C-EUC0805K  [C0805K]
C94  100nF  C-EUC0805K  [C0805K]
C102  100n  C-EUC0805K  [C0805K]
IC15  4067D  [SO24W]
R12  10k  R-US_R0805  [R0805]
R13  10k  R-US_R0805  [R0805]
R14  330  R-US_R0805  [R0805]
R20  10k  R-US_R0805  [R0805]
R21  330  R-US_R0805  [R0805]
R22  10k  R-US_R0805  [R0805]
R23  330  R-US_R0805  [R0805]
R24  10k  R-US_R0805  [R0805]
R25  330  R-US_R0805  [R0805]
R26  10k  R-US_R0805  [R0805]
R27  330  R-US_R0805  [R0805]
R28  10k  R-US_R0805  [R0805]
R29  330  R-US_R0805  [R0805]
R32  330  R-US_R0805  [R0805]

### Nets
+3V3: B2.1 B2.2 B3.1 B3.2 B4.1 B4.2 B5.1 B5.2 B6.1 B6.2 B7.1 B7.2 B8.1 B8.2 C102.1 IC15.24(VDD) ; also sheet 3,5,6,7,8,9,10,12,13,14
GND: C24.2 C35.2 C36.2 C37.2 C38.2 C39.2 C94.2 C102.2 IC15.2(X7) IC15.12(VSS) IC15.13(D) IC15.15(INH) IC15.16(X15) IC15.17(X14) IC15.18(X13) IC15.19(X12) IC15.20(X11) IC15.21(X10) IC15.22(X9) IC15.23(X8) R12.2 R13.2 R20.2 R22.2 R24.2 R26.2 R28.2 ; also sheet 1,2,3,4,5,6,7,8,9,10,12,13,14,15,16
MUX_SEL_A: IC15.10(A) ; also sheet 7,9
MUX_SEL_B: IC15.11(B) ; also sheet 7,9
MUX_SEL_C: IC15.14(C) ; also sheet 7,9
N$25: C35.1 IC15.6(X3) R21.1
N$29: B3.3 B3.4 R20.1 R21.2
N$31: B5.3 B5.4 R22.1 R23.2
N$33: B6.3 B6.4 R24.1 R25.2
N$35: B7.3 B7.4 R26.1 R27.2
N$37: B8.3 B8.4 R28.1 R29.2
N$43: B4.3 B4.4 R12.1 R32.2
N$46: B2.3 B2.4 R13.1 R14.2
PB_2: C36.1 IC15.7(X2) R23.1
PB_3: C37.1 IC15.4(X5) R25.1
PB_4: C38.1 IC15.3(X6) R27.1
PB_5: C39.1 IC15.5(X4) R29.1
PB_6: C24.1 IC15.8(X1) R14.1
PB_7: C94.1 IC15.9(X0) R32.1
PB_ARRAY: IC15.1(X) ; also sheet 7

### Notes on the sheet
- User inputs (digital)

## Sheet 12 of 16
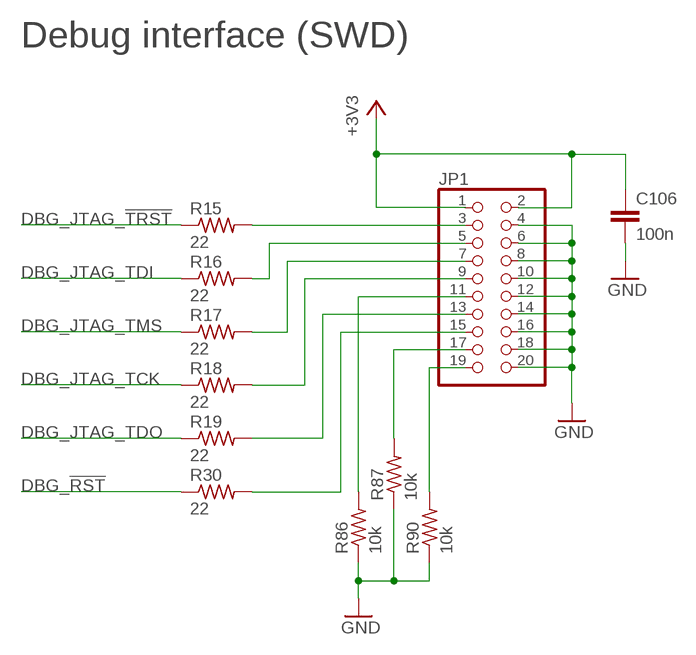
[diagram p11: schematic, sheet 12]

### Parts
C106  100n  C-EUC0805K  [C0805K]
JP1  PINHD-2X10  [2X10]
R15  22  R-US_R0805  [R0805]
R16  22  R-US_R0805  [R0805]
R17  22  R-US_R0805  [R0805]
R18  22  R-US_R0805  [R0805]
R19  22  R-US_R0805  [R0805]
R30  22  R-US_R0805  [R0805]
R86  10k  R-US_R0805  [R0805]
R87  10k  R-US_R0805  [R0805]
R90  10k  R-US_R0805  [R0805]

### Nets
+3V3: C106.1 JP1.1 JP1.2 ; also sheet 3,5,6,7,8,9,10,11,13,14
DBG_!RST: R30.1 ; also sheet 6
DBG_JTAG_!TRST: R15.1 ; also sheet 7
DBG_JTAG_TCK: R18.1 ; also sheet 7
DBG_JTAG_TDI: R16.1 ; also sheet 7
DBG_JTAG_TDO: R19.1 ; also sheet 7
DBG_JTAG_TMS: R17.1 ; also sheet 7
GND: C106.2 JP1.4 JP1.6 JP1.8 JP1.10 JP1.12 JP1.14 JP1.16 JP1.18 JP1.20 R86.1 R87.1 R90.1 ; also sheet 1,2,3,4,5,6,7,8,9,10,11,13,14,15,16
N$23: JP1.3 R15.2
N$27: JP1.5 R16.2
N$28: JP1.7 R17.2
N$30: JP1.9 R18.2
N$32: JP1.13 R19.2
N$34: JP1.15 R30.2
N$143: JP1.19 R90.2
N$144: JP1.17 R87.2
N$145: JP1.11 R86.2

### Notes on the sheet
- Debug interface (SWD)

## Sheet 13 of 16
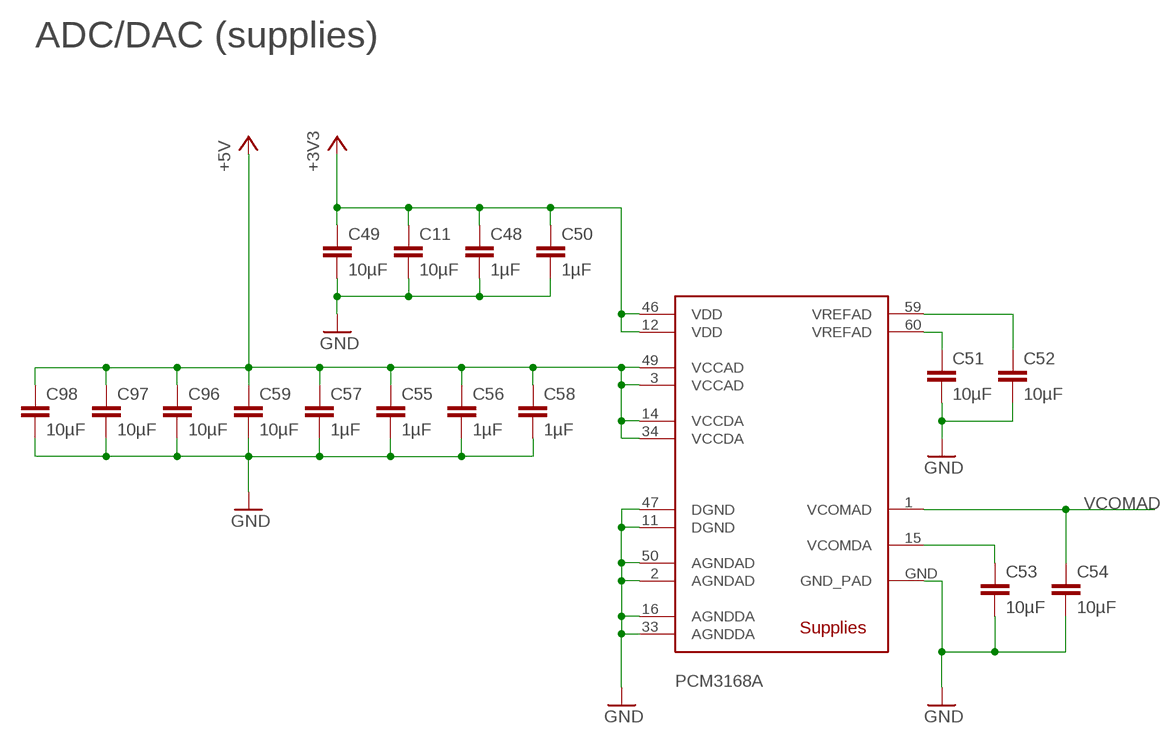
[diagram p12: schematic, sheet 13]

### Parts
C11  10µF  C-EUC0805K  [C0805K]
C48  1µF  C-EUC0805K  [C0805K]
C49  10µF  C-EUC0805K  [C0805K]
C50  1µF  C-EUC0805K  [C0805K]
C51  10µF  C-EUC0805K  [C0805K]
C52  10µF  C-EUC0805K  [C0805K]
C53  10µF  C-EUC0805K  [C0805K]
C54  10µF  C-EUC0805K  [C0805K]
C55  1µF  C-EUC0805K  [C0805K]
C56  1µF  C-EUC0805K  [C0805K]
C57  1µF  C-EUC0805K  [C0805K]
C58  1µF  C-EUC0805K  [C0805K]
C59  10µF  C-EUC0805K  [C0805K]
C96  10µF  C-EUC0805K  [C0805K]
C97  10µF  C-EUC0805K  [C0805K]
C98  10µF  C-EUC0805K  [C0805K]
U$8  PCM3168A  [HTQFP64]

### Nets
+3V3: C11.1 C48.1 C49.1 C50.1 U$8.12(SUPPLIES:VDD) U$8.46(SUPPLIES:VDD) ; also sheet 3,5,6,7,8,9,10,11,12,14
+5V: C55.1 C56.1 C57.1 C58.1 C59.1 C96.1 C97.1 C98.1 U$8.3(SUPPLIES:VCCAD) U$8.14(SUPPLIES:VCCDA) U$8.34(SUPPLIES:VCCDA) U$8.49(SUPPLIES:VCCAD) ; also sheet 2,3,5,7,8
GND: C11.2 C48.2 C49.2 C50.2 C51.2 C52.2 C53.2 C54.2 C55.2 C56.2 C57.2 C58.2 C59.2 C96.2 C97.2 C98.2 U$8.2(SUPPLIES:AGNDAD) U$8.11(SUPPLIES:DGND) U$8.16(SUPPLIES:AGNDDA) U$8.33(SUPPLIES:AGNDDA) U$8.47(SUPPLIES:DGND) U$8.50(SUPPLIES:AGNDAD) U$8.GND(SUPPLIES:GND_PAD) ; also sheet 1,2,3,4,5,6,7,8,9,10,11,12,14,15,16
N$40: C51.1 U$8.60(SUPPLIES:VREFAD)
N$41: C52.1 U$8.59(SUPPLIES:VREFAD)
N$42: C53.1 U$8.15(SUPPLIES:VCOMDA)
VCOMAD: C54.1 U$8.1(SUPPLIES:VCOMAD) ; also sheet 15

### Notes on the sheet
- ADC/DAC (supplies)

## Sheet 14 of 16
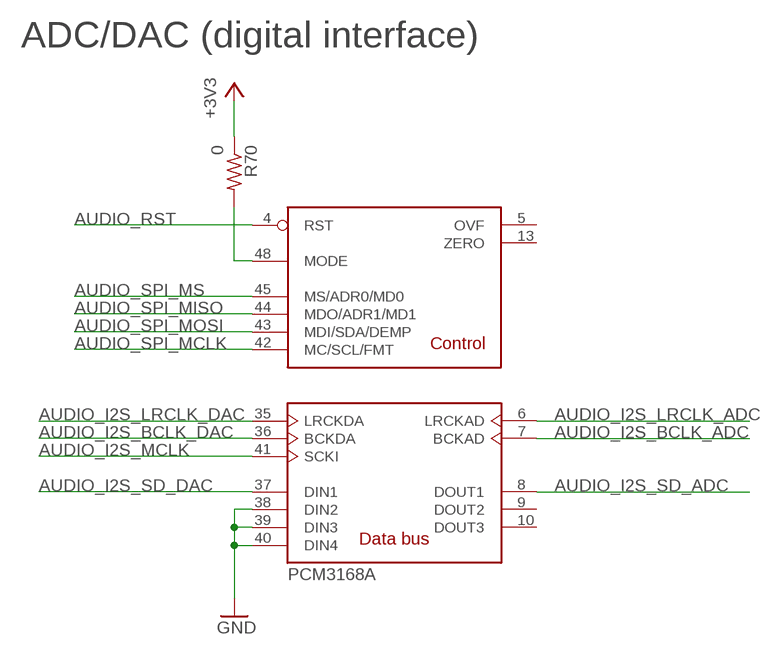
[diagram p13: schematic, sheet 14]

### Parts
R70  0  R-US_R0805  [R0805]

### Nets
+3V3: R70.1 ; also sheet 3,5,6,7,8,9,10,11,12,13
AUDIO_I2S_BCLK_ADC: U$8.7(DATA_BUS:BCKAD) ; also sheet 7
AUDIO_I2S_BCLK_DAC: U$8.36(DATA_BUS:BCKDA) ; also sheet 7
AUDIO_I2S_LRCLK_ADC: U$8.6(DATA_BUS:LRCKAD) ; also sheet 7
AUDIO_I2S_LRCLK_DAC: U$8.35(DATA_BUS:LRCKDA) ; also sheet 7
AUDIO_I2S_MCLK: U$8.41(DATA_BUS:SCKI) ; also sheet 7
AUDIO_I2S_SD_ADC: U$8.8(DATA_BUS:DOUT1) ; also sheet 7
AUDIO_I2S_SD_DAC: U$8.37(DATA_BUS:DIN1) ; also sheet 7
AUDIO_RST: U$8.4(CONTROL:RST) ; also sheet 7
AUDIO_SPI_MCLK: U$8.42(CONTROL:MC/SCL/FMT) ; also sheet 7
AUDIO_SPI_MISO: U$8.44(CONTROL:MDO/ADR1/MD1) ; also sheet 7
AUDIO_SPI_MOSI: U$8.43(CONTROL:MDI/SDA/DEMP) ; also sheet 7
AUDIO_SPI_MS: U$8.45(CONTROL:MS/ADR0/MD0) ; also sheet 7
GND: U$8.38(DATA_BUS:DIN2) U$8.39(DATA_BUS:DIN3) U$8.40(DATA_BUS:DIN4) ; also sheet 1,2,3,4,5,6,7,8,9,10,11,12,13,15,16
N$90: R70.2 U$8.48(CONTROL:MODE)
Unconnected: U$8.5(CONTROL:OVF) U$8.9(DATA_BUS:DOUT2) U$8.10(DATA_BUS:DOUT3) U$8.13(CONTROL:ZERO)

### Notes on the sheet
- ADC/DAC (digital interface)
- PCM3168A

## Sheet 15 of 16
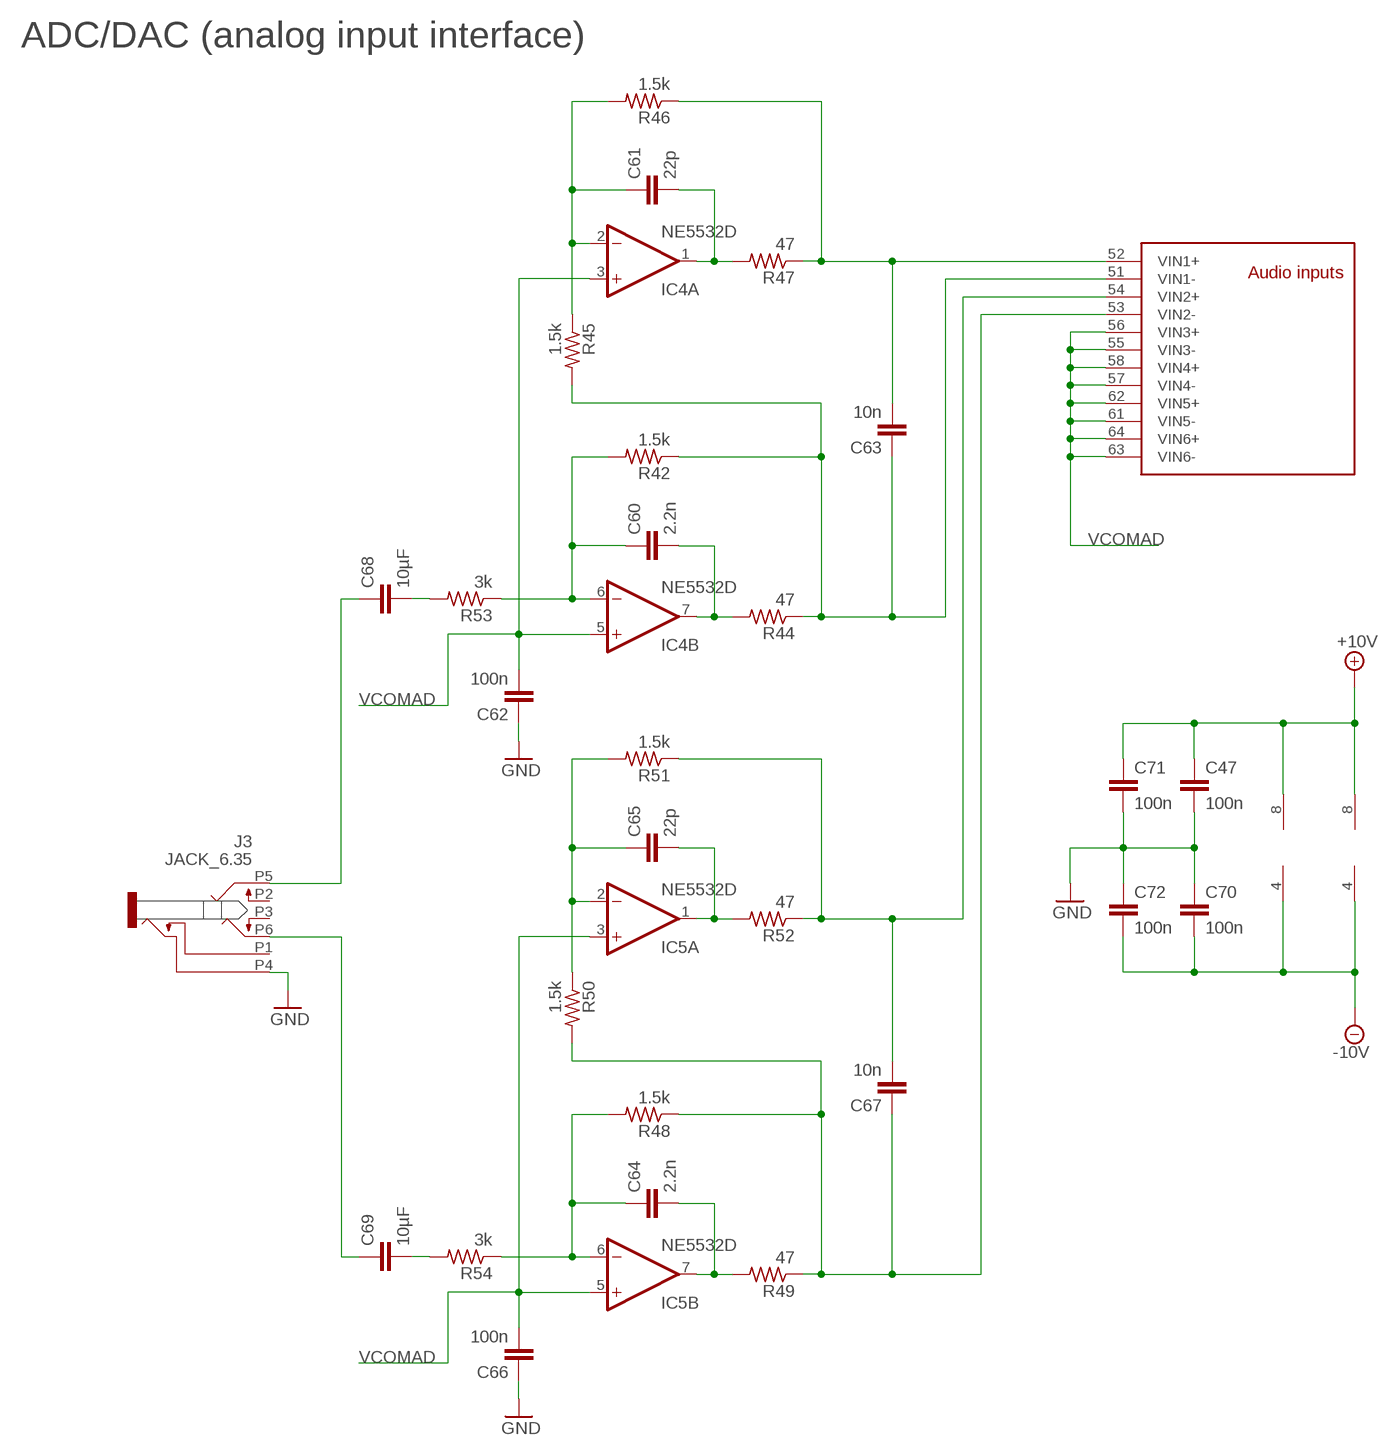
[diagram p14: schematic, sheet 15]

### Parts
C47  100n  C-EUC0805K  [C0805K]
C60  2.2n  C-EUC0805K  [C0805K]
C61  22p  C-EUC0805K  [C0805K]
C62  100n  C-EUC0805K  [C0805K]
C63  10n  C-EUC0805K  [C0805K]
C64  2.2n  C-EUC0805K  [C0805K]
C65  22p  C-EUC0805K  [C0805K]
C66  100n  C-EUC0805K  [C0805K]
C67  10n  C-EUC0805K  [C0805K]
C68  10µF  C-EUC0805K  [C0805K]
C69  10µF  C-EUC0805K  [C0805K]
C70  100n  C-EUC0805K  [C0805K]
C71  100n  C-EUC0805K  [C0805K]
C72  100n  C-EUC0805K  [C0805K]
IC4  NE5532D  [SO08]
IC5  NE5532D  [SO08]
J3  JACK_6.35  [JACK_6.35]
R42  1.5k  R-US_R0805  [R0805]
R44  47  R-US_R0805  [R0805]
R45  1.5k  R-US_R0805  [R0805]
R46  1.5k  R-US_R0805  [R0805]
R47  47  R-US_R0805  [R0805]
R48  1.5k  R-US_R0805  [R0805]
R49  47  R-US_R0805  [R0805]
R50  1.5k  R-US_R0805  [R0805]
R51  1.5k  R-US_R0805  [R0805]
R52  47  R-US_R0805  [R0805]
R53  3k  R-US_R0805  [R0805]
R54  3k  R-US_R0805  [R0805]

### Nets
+10V: C47.1 C71.1 IC4.8(P:V+) IC5.8(P:V+) ; also sheet 4,16
-10V: C70.2 C72.2 IC4.4(P:V-) IC5.4(P:V-) ; also sheet 4,16
GND: C47.2 C62.1 C66.1 C70.1 C71.2 C72.1 J3.P4 ; also sheet 1,2,3,4,5,6,7,8,9,10,11,12,13,14,16
N$52: C60.1 IC4.6(B:-IN) R42.2 R53.1
N$53: C60.2 IC4.7(B:OUT) R44.2
N$54: C63.1 R42.1 R44.1 R45.2 U$8.51(AUDIO_IN:VIN1-)
N$55: C61.1 IC4.2(A:-IN) R45.1 R46.2
N$56: C61.2 IC4.1(A:OUT) R47.2
N$57: C64.1 IC5.6(B:-IN) R48.2 R54.1
N$59: C64.2 IC5.7(B:OUT) R49.2
N$60: C67.1 R48.1 R49.1 R50.2 U$8.53(AUDIO_IN:VIN2-)
N$61: C65.1 IC5.2(A:-IN) R50.1 R51.2
N$62: C65.2 IC5.1(A:OUT) R52.2
N$64: C69.2 R54.2
N$65: C67.2 R51.1 R52.1 U$8.54(AUDIO_IN:VIN2+)
N$66: C68.2 R53.2
N$67: C63.2 R46.1 R47.1 U$8.52(AUDIO_IN:VIN1+)
N$68: C68.1 J3.P5
N$69: C69.1 J3.P6
VCOMAD: C62.2 C66.2 IC4.3(A:+IN) IC4.5(B:+IN) IC5.3(A:+IN) IC5.5(B:+IN) U$8.55(AUDIO_IN:VIN3-) U$8.56(AUDIO_IN:VIN3+) U$8.57(AUDIO_IN:VIN4-) U$8.58(AUDIO_IN:VIN4+) U$8.61(AUDIO_IN:VIN5-) U$8.62(AUDIO_IN:VIN5+) U$8.63(AUDIO_IN:VIN6-) U$8.64(AUDIO_IN:VIN6+) ; also sheet 13
Unconnected: J3.P1 J3.P2 J3.P3

### Notes on the sheet
- ADC/DAC (analog input interface)

## Sheet 16 of 16
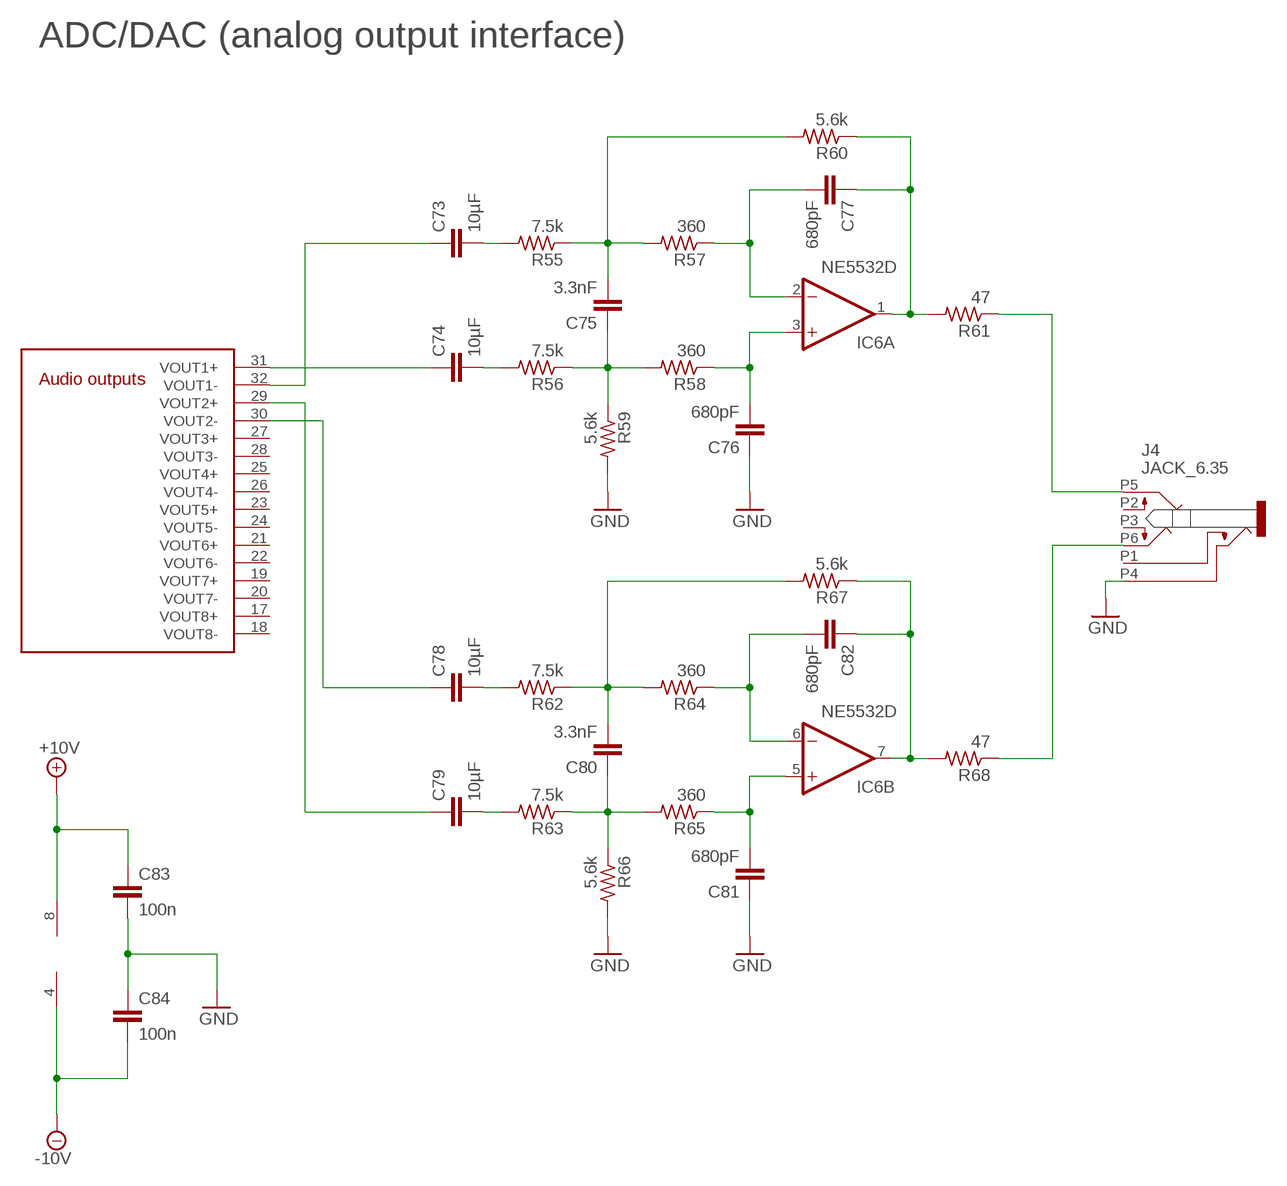
[diagram p15: schematic, sheet 16]

### Parts
C73  10µF  C-EUC0805K  [C0805K]
C74  10µF  C-EUC0805K  [C0805K]
C75  3.3nF  C-EUC0805K  [C0805K]
C76  680pF  C-EUC0805K  [C0805K]
C77  680pF  C-EUC0805K  [C0805K]
C78  10µF  C-EUC0805K  [C0805K]
C79  10µF  C-EUC0805K  [C0805K]
C80  3.3nF  C-EUC0805K  [C0805K]
C81  680pF  C-EUC0805K  [C0805K]
C82  680pF  C-EUC0805K  [C0805K]
C83  100n  C-EUC0805K  [C0805K]
C84  100n  C-EUC0805K  [C0805K]
IC6  NE5532D  [SO08]
J4  JACK_6.35  [JACK_6.35]
R55  7.5k  R-US_R0805  [R0805]
R56  7.5k  R-US_R0805  [R0805]
R57  360  R-US_R0805  [R0805]
R58  360  R-US_R0805  [R0805]
R59  5.6k  R-US_R0805  [R0805]
R60  5.6k  R-US_R0805  [R0805]
R61  47  R-US_R0805  [R0805]
R62  7.5k  R-US_R0805  [R0805]
R63  7.5k  R-US_R0805  [R0805]
R64  360  R-US_R0805  [R0805]
R65  360  R-US_R0805  [R0805]
R66  5.6k  R-US_R0805  [R0805]
R67  5.6k  R-US_R0805  [R0805]
R68  47  R-US_R0805  [R0805]

### Nets
+10V: C83.1 IC6.8(P:V+) ; also sheet 4,15
-10V: C84.2 IC6.4(P:V-) ; also sheet 4,15
GND: C76.1 C81.1 C83.2 C84.1 J4.P4 R59.2 R66.2 ; also sheet 1,2,3,4,5,6,7,8,9,10,11,12,13,14,15
N$38: C78.1 U$8.30(AUDIO_OUT:VOUT2-)
N$50: C75.1 R56.1 R58.2 R59.1
N$70: C75.2 R55.1 R57.2 R60.2
N$71: C73.2 R55.2
N$72: C74.2 R56.2
N$73: C77.2 IC6.2(A:-IN) R57.1
N$74: C76.2 IC6.3(A:+IN) R58.1
N$75: C77.1 IC6.1(A:OUT) R60.1 R61.2
N$76: J4.P5 R61.1
N$77: C74.1 U$8.31(AUDIO_OUT:VOUT1+)
N$78: C73.1 U$8.32(AUDIO_OUT:VOUT1-)
N$79: C80.1 R63.1 R65.2 R66.1
N$80: C80.2 R62.1 R64.2 R67.2
N$81: C78.2 R62.2
N$82: C79.2 R63.2
N$83: C82.2 IC6.6(B:-IN) R64.1
N$84: C81.2 IC6.5(B:+IN) R65.1
N$85: C82.1 IC6.7(B:OUT) R67.1 R68.2
N$86: J4.P6 R68.1
N$87: C79.1 U$8.29(AUDIO_OUT:VOUT2+)
Unconnected: J4.P1 J4.P2 J4.P3 U$8.17(AUDIO_OUT:VOUT8+) U$8.18(AUDIO_OUT:VOUT8-) U$8.19(AUDIO_OUT:VOUT7+) U$8.20(AUDIO_OUT:VOUT7-) U$8.21(AUDIO_OUT:VOUT6+) U$8.22(AUDIO_OUT:VOUT6-) U$8.23(AUDIO_OUT:VOUT5+) U$8.24(AUDIO_OUT:VOUT5-) U$8.25(AUDIO_OUT:VOUT4+) U$8.26(AUDIO_OUT:VOUT4-) U$8.27(AUDIO_OUT:VOUT3+) U$8.28(AUDIO_OUT:VOUT3-)

### Notes on the sheet
- ADC/DAC (analog output interface)

## Power pins joined to a net without a drawn wire
SHIELD: J5.GND@1(SHIELD) J5.GND@2(SHIELD)
TRACK: IC9.2(TRACK)

## Library data of the parts
B1-B8 = qb_lib:KSC521G: KSC521G Boutton poussoir de C&K COMPONENTS. Référence Farnell : 2845724
C1-C22 C24-C28 C30-C42 C44 C46-C98 C101-C106 = rcl:C-EU: CAPACITOR, European symbol; SPICEPREFIX: C
C23 C29 C43 C45 C99 C100 = rcl:CPOL-EU: POLARIZED CAPACITOR, European symbol; SPICEPREFIX: C
D1 D2 = qb_lib:PGB002ST23
H1-H4 = holes:MOUNT-PAD-ROUND: MOUNTING PAD, round
IC1 = ftdichip:FT232R: Source: http://www.ftdichip.com/Documents/DataSheets/DS_FT232R_v104.pdf; MPN: FT232RL; OC_FARNELL: 1146032; OC_NEWARK: 91K9918
IC2 IC13 = 40xx:4051: 8-channel ANALOG MULTIPLEXER
IC3 = linear-technology:LT1963AEQ*: LT1963 1.5A, Low Noise, Fast Transient Response LDO Regulator Source: http://www.linear.com; MPN: LT1963AEQ; OC_FARNELL: 1273625; OC_NEWARK: 57M7427
IC4-IC6 = linear:NE5532: AUDIO AMPLIFIER
IC7 = 74xx-eu:74*595: 8-bit SHIFT REGISTER, output latch
IC8 = qb_lib:PTN78060W
IC9 = qb_lib:PTH04000W
IC10 = qb_lib:PTN78000A
IC11 = qb_lib:LT3015
IC12 = qb_lib:S25FL127S
IC15 = 40xx:4067: 16-channel ANALOG MULTIPLEXER
J1 = qb_lib:MINI-USB-5
J2 = qb_lib:USB_A
J3 J4 = qb_lib:JACK_6.35: Jack connector 6.35mm (CLIFF electronic components) Farnell reference = 2679725 Manufacturer reference = CL12321K
J5 J6 = qb_lib:DIN_5PINS
J7 = qb_lib:JACK_SUPPLY
JP1 = pinhead:PINHD-2X10: PIN HEADER
JP2-JP10 = pinhead:PINHD-1X2: PIN HEADER
JP11 = pinhead:PINHD-1X6: PIN HEADER
L1 L2 = rcl:L-US: INDUCTOR, American symbol; SPICEPREFIX: L
LED1-LED13 = led:LED: LED OSRAM: - CHIPLED LG R971, LG N971, LY N971, LG Q971, LY Q971, LO R971, LY R971 LH N974, LH R974 LS Q976, LO Q976, LY Q976 LO Q996 - Hyper CHIPLED LW Q18S LB Q993, LB Q99A, LB R99A - SideLED LS A670, LO A670, LY A670, LG A670, LP A670 LB A673, LV A673, LT A673, LW A673 LH A674 LY A675 LS A676, LA A676, LO A676, LY A676, LW A676 LS A679, LY A679, LG A679 - Hyper Micro SIDELED® LS Y876, LA Y876, LO Y876, LY Y876 LT Y87S - SmartLED LW L88C, LW L88S LB L89C, LB L89S, LG L890 LS L89K, LO L89K, LY L89K LS L896, LA L896, LO L896, LY L896 - TOPLED LS T670, LO T670, LY T670, LG T670, LP T670 LSG T670, LSP T670, LSY T670, LOP T670, LYG T670 LG T671, LOG T671, LSG T671 LB T673, LV T673, LT T673, LW T673 LH T674 LS T676, LA T676, LO T676, LY T676, LB T676, LH T676, LSB T676, LW T676 LB T67C, LV T67C, LT T67C, LS T67K, LO T67K, LY T67K, LW E67C LS E67B, LA E67B, LO E67B, LY E67B, LB E67C, LV E67C, LT E67C LW T67C LS T679, LY T679, LG T679 LS T770, LO T770, LY T770, LG T770, LP T770 LB T773, LV T773, LT T773, LW T773 LH T774 LS E675, LA E675, LY E675, LS T675 LS T776, LA T776, LO T776, LY T776, LB T776 LHGB T686 LT T68C, LB T68C - Hyper Mini TOPLED® LB M676 - Mini TOPLED Santana® LG M470 LS M47K, LO M47K, LY M47K Source: http://www.osram.convergy.de LUXEON: - LUMILED® LXK2-PW12-R00, LXK2-PW12-S00, LXK2-PW14-U00, LXK2-PW14-V00 LXK2-PM12-R00, LXK2-PM12-S00, LXK2-PM14-U00 LXK2-PE12-Q00, LXK2-PE12-R00, LXK2-PE12-S00, LXK2-PE14-T00, LXK2-PE14-U00 LXK2-PB12-K00, LXK2-PB12-L00, LXK2-PB12-M00, LXK2-PB14-N00, LXK2-PB14-P00, LXK2-PB14-Q00 LXK2-PR12-L00, LXK2-PR12-M00, LXK2-PR14-Q00, LXK2-PR14-R00 LXK2-PD12-Q00, LXK2-PD12-R00, LXK2-PD12-S00 LXK2-PH12-R00, LXK2-PH12-S00 LXK2-PL12-P00, LXK2-PL12-Q00, LXK2-PL12-R00 Source: www.luxeon.com KINGBRIGHT: KA-3528ASYC Source: www.kingbright.com
OK1 = optocoupler:HCPL0600: HEWLETT PACKARD OPTO COUPLER; MF: AGILENT TECHNOLOGIES; MPN: HCPL-0600-000E; OC_FARNELL: 9994696; OC_NEWARK: 88H7774
P1-P6 = qb_lib:PTV09: 9 mm Square Rotary Potentiometers Source: Panasonic
P7 = qb_lib:JOYSTICK_XY: Joystick (XY potentiometer) Supplier reference = RKJXK1210002 (Alps Alpine) Radiospares reference = 123-9576
Q1 = special:XTAL/S: CRYSTAL
Q2 Q4 = transistor-npn:BC847*: NPN Transistor
R1-R90 = rcl:R-US_: RESISTOR, American symbol; SPICEPREFIX: R
S1 = qb_lib:SWITCH_1P
TP1-TP20 = testpad:TP: Test pad
U$1 = qb_lib:STM32H743
U$2 = qb_lib:HYPERPIXEL4.0
U$8 = qb_lib:PCM3168A

## Net classes
1 USB diff pair: width 0.203 mm, clearance 0.025 mm